# EAGLE design eg4duino_fin (EAGLE 7.2.0)
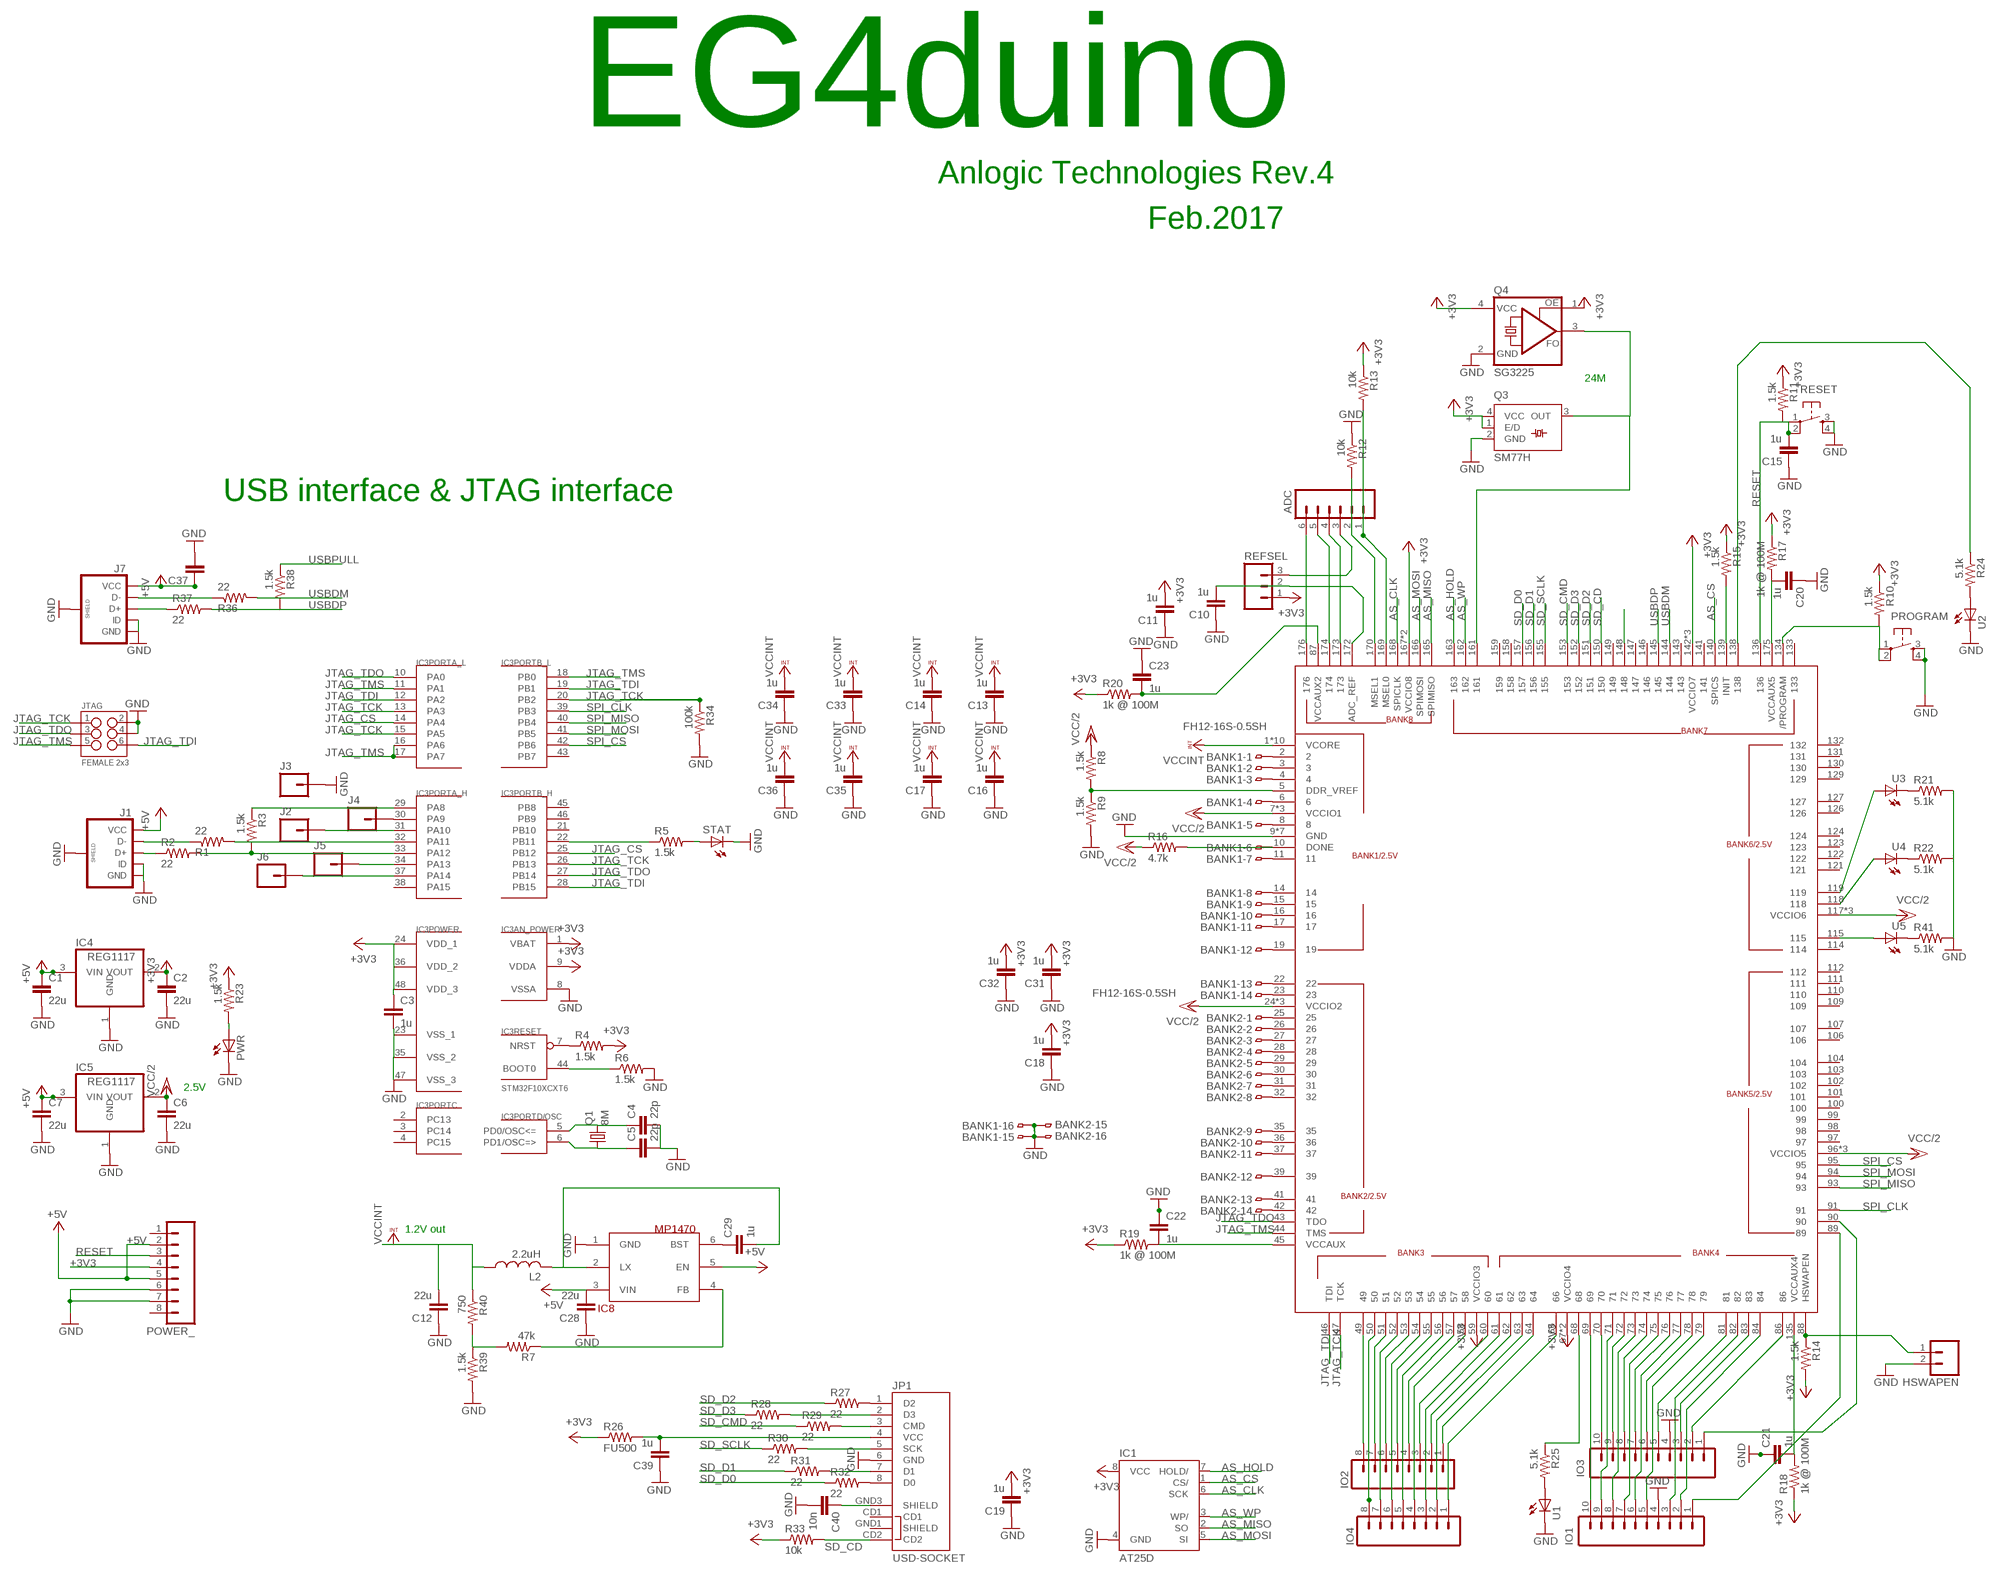
[diagram p0: schematic, sheet 1, part 1 of 2]
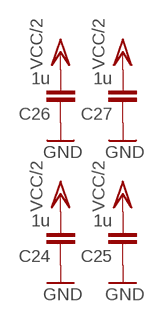
[diagram p1: schematic, sheet 1, part 2 of 2]

## Parts
ADC  M06SILK_FEMALE_PTH  [1X06]
BANK1  FH12-16S-0.5SH  [FH12-16S-0.5SH]
BANK2  FH12-16S-0.5SH  [FH12-16S-0.5SH]
C1  22u  C-EUC0805  [C0805]
C2  22u  C-EUC0805  [C0805]
C3  1u  C-EUC0805  [C0805]
C4  22p  C-EUC0805  [C0805]
C5  22p  C-EUC0805  [C0805]
C6  22u  C-EUC0805  [C0805]
C7  22u  C-EUC0805  [C0805]
C10  1u  C-EUC0805  [C0805]
C11  1u  C-EUC0805  [C0805]
C12  22u  C-EUC0805  [C0805]
C13  1u  C-EUC0805  [C0805]
C14  1u  C-EUC0805  [C0805]
C15  1u  C-EUC0805  [C0805]
C16  1u  C-EUC0805  [C0805]
C17  1u  C-EUC0805  [C0805]
C18  1u  C-EUC0805  [C0805]
C19  1u  C-EUC0805  [C0805]
C20  1u  C-EUC0805  [C0805]
C21  1u  C-EUC0805  [C0805]
C22  1u  C-EUC0805  [C0805]
C23  1u  C-EUC0805  [C0805]
C24  1u  C-EUC0805  [C0805]
C25  1u  C-EUC0805  [C0805]
C26  1u  C-EUC0805  [C0805]
C27  1u  C-EUC0805  [C0805]
C28  22u  C-EUC0805  [C0805]
C29  1u  C-EUC0805  [C0805]
C31  1u  C-EUC0805  [C0805]
C32  1u  C-EUC0805  [C0805]
C33  1u  C-EUC0805  [C0805]
C34  1u  C-EUC0805  [C0805]
C35  1u  C-EUC0805  [C0805]
C36  1u  C-EUC0805  [C0805]
C37  C-EUC0805  [C0805]
C39  1u  C-EUC0805  [C0805]
C40  10n  C-EUC0805  [C0805]
HSWAPEN  M02PTH  [1X02]
IC1  AT25D  [SOIC8]
IC2  EG4D20EG176  [ELQFP176L]
IC3  STM32F10XCXT6  [TQFP48]
IC4  REG1117  [SOT223]
IC5  REG1117  [SOT223]
IC8  MP1470  [SOT23-6L]
IO1  M10SILK_FEMALE_PTH  [1X10]
IO2  M08SILK_FEMALE_PTH  [1X08]
IO3  M10SILK_FEMALE_PTH  [1X10]
IO4  M08SILK_FEMALE_PTH  [1X08]
J1  USB_MICROB_PLUGCONN-11752  [USB-B-MICRO-SMD_V03]
J2  M01  [0805SMD]
J3  M01  [0805SMD]
J4  M01  [0805SMD]
J5  M01  [0805SMD]
J6  M01  [0805SMD]
J7  USB_MICROB_PLUGCONN-11752  [USB-B-MICRO-SMD_V03]
JP1  USD-SOCKET  [MICROSD_1:1]
JTAG  FEMALE 2x3  M03X2FEMALE  [2X3]
L2  2.2uH  L-USL4532P  [L4532P]
POWER_  M08SILK_FEMALE_PTH  [1X08]
PROGRAM  10-XXSMD  [B3F-10SMD]
PWR  LEDCHIP-LED0805  [CHIP-LED0805]
Q1  8M  CRYSTALHC49S  [HC49/S]
Q3  SM77H  [SM77H]
Q4  SG3225  [3225]
R1  22  R-US_M0805  [M0805]
R2  22  R-US_M0805  [M0805]
R3  1.5k  R-US_M0805  [M0805]
R4  1.5k  R-US_M0805  [M0805]
R5  1.5k  R-US_M0805  [M0805]
R6  1.5k  R-US_M0805  [M0805]
R7  47k  R-US_R0805  [R0805]
R8  1.5k  R-US_R0805  [R0805]
R9  1.5k  R-US_R0805  [R0805]
R10  1.5k  R-US_R0603  [R0603]
R11  1.5k  R-US_R0805  [R0805]
R12  10k  R-US_R0805  [R0805]
R13  10k  R-US_R0805  [R0805]
R14  1.5k  R-US_R0805  [R0805]
R15  1.5k  R-US_R0805  [R0805]
R16  4.7k  R-US_R0603  [R0603]
R17  1k @ 100M  R-US_R0805  [R0805]
R18  1k @ 100M  R-US_R0805  [R0805]
R19  1k @ 100M  R-US_R0805  [R0805]
R20  1k @ 100M  R-US_R0805  [R0805]
R21  5.1k  R-US_M0805  [M0805]
R22  5.1k  R-US_M0805  [M0805]
R23  1.5k  R-US_M0805  [M0805]
R24  5.1k  R-US_M0805  [M0805]
R25  5.1k  R-US_M0805  [M0805]
R26  FU500  R-US_R0805  [R0805]
R27  22  R-US_R0201  [R0201]
R28  22  R-US_R0201  [R0201]
R29  22  R-US_R0201  [R0201]
R30  22  R-US_R0201  [R0201]
R31  22  R-US_R0201  [R0201]
R32  22  R-US_R0201  [R0201]
R33  10k  R-US_R0805  [R0805]
R34  100k  R-US_R0603  [R0603]
R36  22  R-US_R0603W  [R0603W]
R37  22  R-US_R0603W  [R0603W]
R38  1.5k  R-US_R0603  [R0603]
R39  1.5k  R-US_R0805  [R0805]
R40  750  R-US_R0805  [R0805]
R41  5.1k  R-US_M0805  [M0805]
REFSEL  M03PTH  [1X03]
RESET  10-XXSMD  [B3F-10SMD]
STAT  LEDCHIP-LED0805  [CHIP-LED0805]
U1  LEDCHIP-LED0805  [CHIP-LED0805]
U2  LEDCHIP-LED0805  [CHIP-LED0805]
U3  LEDCHIP-LED0805  [CHIP-LED0805]
U4  LEDCHIP-LED0805  [CHIP-LED0805]
U5  LEDCHIP-LED0805  [CHIP-LED0805]

## Nets
+3V3: C2.1 C3.1 C11.2 C18.2 C19.2 C31.2 C32.2 IC1.8(VCC) IC2.59(VCCIO3) IC2.67(VCCIO4) IC2.80(VCCIO4) IC2.142(VCCIO7) IC2.154(VCCIO7) IC2.160(VCCIO7) IC2.167(VCCIO8) IC2.171(VCCIO8) IC3.1(AN_POWER:VBAT) IC3.9(AN_POWER:VDDA) IC3.24(POWER:VDD_1) IC3.36(POWER:VDD_2) IC3.48(POWER:VDD_3) IC4.2(VOUT) POWER_.4 Q3.1(E/D) Q3.4(VCC) Q4.1(OE) Q4.4(VCC) R4.2 R10.1 R11.1 R13.1 R14.2 R15.1 R17.1 R18.1 R19.1 R20.1 R23.1 R26.1 R33.1 REFSEL.1
+5V [usbvcc]: C1.1 C7.1 C28.2 C37.1 IC4.3(VIN) IC5.3(VIN) IC8.3(VIN) IC8.5(EN) J1.VBUS(VCC) J7.VBUS(VCC) POWER_.2 POWER_.5
AS_CLK: IC1.6(SCK) IC2.168(SPICLK)
AS_CS: IC1.1(CS/) IC2.140(SPICS)
AS_HOLD: IC1.7(HOLD/) IC2.163
AS_MISO: IC1.2(SO) IC2.165(SPIMISO)
AS_MOSI: IC1.5(SI) IC2.166(SPIMOSI)
AS_WP: IC1.3(WP/) IC2.162
GND [gnd]: BANK1.15 BANK1.16 BANK2.15 BANK2.16 C1.2 C2.2 C3.2 C4.2 C5.2 C6.2 C7.2 C10.1 C11.1 C12.1 C13.1 C14.1 C15.1 C16.1 C17.1 C18.1 C19.1 C20.1 C21.1 C22.1 C23.1 C24.1 C25.1 C26.1 C27.1 C28.1 C31.1 C32.1 C33.1 C34.1 C35.1 C36.1 C37.2 C39.1 C40.2 HSWAPEN.2 IC1.4(GND) IC2.9(GND) IC2.13(GND) IC2.21(GND) IC2.33(GND) IC2.38(GND) IC2.116(GND) IC2.EGND(GND) IC3.8(AN_POWER:VSSA) IC3.23(POWER:VSS_1) IC3.35(POWER:VSS_2) IC3.47(POWER:VSS_3) IC4.1(GND) IC5.1(GND) IC8.1(GND) IO1.4 IO3.4 J1.GND J1.ID J1.SHIELD1(SHIELD) J1.SHIELD2(SHIELD) J1.SHIELD3(SHIELD) J3.1 J7.GND J7.ID J7.SHIELD1(SHIELD) J7.SHIELD2(SHIELD) J7.SHIELD3(SHIELD) JP1.6(GND) JTAG.2 JTAG.4 POWER_.6 POWER_.7 PROGRAM.3(S) PROGRAM.4(S1) PWR.C Q3.2(GND) Q4.2(GND) R6.2 R9.2 R12.1 R21.2 R22.2 R34.2 R39.2 R41.2 RESET.3(S) RESET.4(S1) STAT.C U1.C U2.C
JTAG_CS: IC3.14(PORTA_L:PA4) IC3.25(PORTB_H:PB12)
JTAG_TCK: IC2.47(TCK) IC3.13(PORTA_L:PA3) IC3.15(PORTA_L:PA5) IC3.20(PORTB_L:PB2) IC3.26(PORTB_H:PB13) JTAG.1 R34.1
JTAG_TDI: IC2.46(TDI) IC3.12(PORTA_L:PA2) IC3.19(PORTB_L:PB1) IC3.28(PORTB_H:PB15) JTAG.6
JTAG_TDO: IC2.43(TDO) IC3.10(PORTA_L:PA0) IC3.27(PORTB_H:PB14) JTAG.3
JTAG_TMS: IC2.44(TMS) IC3.11(PORTA_L:PA1) IC3.16(PORTA_L:PA6) IC3.17(PORTA_L:PA7) IC3.18(PORTB_L:PB0) JTAG.5
N$1: ADC.6 IC2.176
N$2: ADC.5 IC2.174
N$3: ADC.4 IC2.173
N$4: ADC.3 REFSEL.3
N$5: ADC.2 IC2.170(MSEL1) R12.2
N$6: ADC.1 IC2.169(MSEL0) R13.2
N$7: IC2.69 IO1.10
N$8: IC2.70 IO3.10
N$9: IC2.71 IO1.9
N$10: IC2.72 IO3.9
N$11: IC2.73 IO1.8
N$12: IC2.74 IO3.8
N$13: IC2.75 IO1.7
N$14: IC2.76 IO3.7
N$15: IC2.77 IO1.6
N$16: IC2.78 IO3.6
N$17: IC2.79 IO1.5
N$18: IC2.83 IO3.3
N$19: IC2.81 IO3.5
N$20: IC2.82 IO1.3
N$21: IC2.84 IO1.2
N$22: IC2.86 IO3.2
N$23: IC2.89 IO1.1
N$24: IC2.90 IO3.1
N$25: J1.D+ R2.1
N$26: J1.D- R1.1
N$27: IC3.32(PORTA_H:PA11) R1.2
N$28: IC3.33(PORTA_H:PA12) R2.2 R3.2
N$29: IC3.29(PORTA_H:PA8) R3.1
N$30: IC3.31(PORTA_H:PA10) J2.1
N$31: IC3.30(PORTA_H:PA9) J4.1
N$32: IC3.7(RESET:NRST) R4.1
N$33: IC3.22(PORTB_H:PB11) R5.1
N$34: R5.2 STAT.A
N$35: C4.1 IC3.5(PORTD/OSC:PD0/OSC<=) Q1.2
N$36: C5.1 IC3.6(PORTD/OSC:PD1/OSC=>) Q1.1
N$37: IC3.44(RESET:BOOT0) R6.1
N$38: IC2.49 IO2.8
N$40: IC2.51 IO2.7
N$42: IC2.53 IO2.6
N$43: IC2.54 IO4.6
N$44: IC2.55 IO2.5
N$45: IC2.56 IO4.5
N$46: IC2.57 IO2.4
N$47: IC2.58 IO4.4
N$48: IC2.60 IO2.3
N$49: IC2.61 IO4.3
N$50: IC2.62 IO2.2
N$51: IC2.63 IO4.2
N$52: IC2.64 IO2.1
N$53: IC2.66 IO4.1
N$54: IC2.161 Q3.3(OUT) Q4.3(FO)
N$55: C10.2 IC2.172(ADC_REF) REFSEL.2
N$56: IC2.119 U3.A
N$57: IC2.118 U4.A
N$58: C29.2 IC8.2(LX) L2.2
N$59: C29.1 IC8.6(BST)
N$60: IC8.4(FB) R7.1
N$61: R7.2 R39.1 R40.2
N$62: IC2.5(DDR_VREF) R8.2 R9.1
N$63: BANK1.1 IC2.2
N$64: BANK1.2 IC2.3
N$65: BANK1.3 IC2.4
N$66: BANK1.4 IC2.6
N$67: BANK1.5 IC2.8
N$68: IC3.34(PORTA_H:PA13) J5.1
N$69: BANK1.7 IC2.11
N$70: BANK1.8 IC2.14
N$71: BANK1.9 IC2.15
N$72: BANK1.10 IC2.16
N$73: BANK1.11 IC2.17
N$74: BANK1.12 IC2.19
N$75: BANK1.13 IC2.22
N$76: BANK1.14 IC2.23
N$77: BANK2.1 IC2.25
N$78: BANK2.2 IC2.26
N$79: BANK2.3 IC2.27
N$80: BANK2.4 IC2.28
N$81: BANK2.5 IC2.29
N$82: BANK2.6 IC2.30
N$83: BANK2.7 IC2.31
N$84: BANK2.8 IC2.32
N$85: BANK2.9 IC2.35
N$86: BANK2.10 IC2.36
N$87: BANK2.11 IC2.37
N$88: BANK2.12 IC2.39
N$89: BANK2.13 IC2.41
N$90: BANK2.14 IC2.42
N$91: C20.2 IC2.175(VCCAUX5) R17.2
N$92: HSWAPEN.1 IC2.88(HSWAPEN) R14.1
N$93: IC2.139(INIT) R15.2
N$94: C21.2 IC2.135(VCCAUX4) R18.2
N$95: C22.2 IC2.45(VCCAUX) R19.2
N$96: C23.2 IC2.87(VCCAUX2) R20.2
N$97: IC2.115 U5.A
N$98: PWR.A R23.2
N$99: R24.2 U2.A
N$100: IC2.138 R24.1
N$101: R25.2 U1.A
N$102: IC2.68 R25.1
N$103: C39.2 JP1.4(VCC) R26.2
N$104: JP1.1(D2) R27.2
N$105: IC2.134(/PROGRAM) PROGRAM.1(P) PROGRAM.2(P1) R10.2
N$106: JP1.2(D3) R28.2
N$107: JP1.3(CMD) R29.2
N$108: JP1.8(D0) R32.2
N$109: JP1.7(D1) R31.2
N$110: IC3.37(PORTA_H:PA14) J6.1
N$111: JP1.5(SCK) R30.2
N$112: C40.1 JP1.GND3(SHIELD)
N$114: BANK1.6 IC2.10(DONE) R16.2
N$116: J7.D- R36.1
N$117: J7.D+ R37.1
N$118: R21.1 U3.C
N$119: R22.1 U4.C
N$120: R41.1 U5.C
RESET: C15.2 IC2.136 POWER_.3 R11.2 RESET.1(P) RESET.2(P1)
SD_CD: IC2.150 JP1.CD2 R33.2
SD_CMD: IC2.153 R29.1
SD_D0: IC2.157 R32.1
SD_D1: IC2.156 R31.1
SD_D2: IC2.151 R27.1
SD_D3: IC2.152 R28.1
SD_SCLK: IC2.155 R30.1
SPI_CLK: IC2.91 IC3.39(PORTB_L:PB3)
SPI_CS: IC2.95 IC3.42(PORTB_L:PB6)
SPI_MISO: IC2.93 IC3.40(PORTB_L:PB4)
SPI_MOSI: IC2.94 IC3.41(PORTB_L:PB5)
USBDM: IC2.144 R36.2
USBDP: IC2.145 R37.2 R38.2
USBPULL: IC2.148 R38.1
USER_RX: IC2.52 IO4.7
USER_TX: IC2.50 IO4.8
VCC/2: C6.1 C24.2 C25.2 C26.2 C27.2 IC2.7(VCCIO1) IC2.12(VCCIO1) IC2.18(VCCIO1) IC2.24(VCCIO2) IC2.34(VCCIO2) IC2.40(VCCIO2) IC2.96(VCCIO5) IC2.105(VCCIO5) IC2.108(VCCIO5) IC2.117(VCCIO6) IC2.120(VCCIO6) IC2.125(VCCIO6) IC5.2(VOUT) R8.1 R16.1
VCCINT: C12.2 C13.2 C14.2 C16.2 C17.2 C33.2 C34.2 C35.2 C36.2 IC2.1(VCORE) IC2.20(VCORE) IC2.48(VCORE) IC2.65(VCORE) IC2.85(VCORE) IC2.92(VCORE) IC2.113(VCORE) IC2.128(VCORE) IC2.137(VCORE) IC2.164(VCORE) L2.1 R40.1
Unconnected: IC2.97 IC2.98 IC2.99 IC2.100 IC2.101 IC2.102 IC2.103 IC2.104 IC2.106 IC2.107 IC2.109 IC2.110 IC2.111 IC2.112 IC2.114 IC2.121 IC2.122 IC2.123 IC2.124 IC2.126 IC2.127 IC2.129 IC2.130 IC2.131 IC2.132 IC2.133 IC2.141 IC2.143 IC2.146 IC2.147 IC2.149 IC2.158 IC2.159 IC3.2(PORTC:PC13) IC3.3(PORTC:PC14) IC3.4(PORTC:PC15) IC3.21(PORTB_H:PB10) IC3.38(PORTA_H:PA15) IC3.43(PORTB_L:PB7) IC3.45(PORTB_H:PB8) IC3.46(PORTB_H:PB9) JP1.CD1 JP1.GND1(SHIELD) POWER_.1 POWER_.8

## Notes on the sheet
- EG4duino
- Anlogic Technologies Rev.4
- Feb.2017
- 24M
- USB interface & JTAG interface
- 2.5V
- 1.2V out

## Library data of the parts
ADC = SparkFun-Connectors:M06: Header 6 Standard 6-pin 0.1" header. Use with straight break away headers (SKU : PRT-00116), right angle break away headers (PRT-00553), swiss pins (PRT-00743), machine pins (PRT-00117), and female headers (PRT-00115). Molex polarized connector foot print use with SKU : PRT-08094 with associated crimp pins and housings. NOTES ON THE VARIANTS LOCK and LOCK_LONGPADS... This footprint was designed to help hold the alignment of a through-hole component (i.e. 6-pin header) while soldering it into place. You may notice that each hole has been shifted either up or down by 0.005 of an inch from it's more standard position (which is a perfectly straight line). This slight alteration caused the pins (the squares in the middle) to touch the edges of the holes. Because they are alternating, it causes a "brace" to hold the component in place. 0.005 has proven to be the perfect amount of "off-center" position when using our standard breakaway headers. Although looks a little odd when you look at the bare footprint, once you have a header in there, the alteration is very hard to notice. Also,if you push a header all the way into place, it is covered up entirely on the bottom side. This idea of altering the position of holes to aid alignment will be further integrated into the Sparkfun Library for other footprints. It can help hold any component with 3 or more connection pins.; PROD_ID: CONN-08437
BANK1 BANK2 = con-hirose:FH12-16S-0.5S: 0.5mm Pitch Connectors For FPC/FFC Source: Data sheet <http://www.hirose.co.jp/cataloge_hp/e58605370.pdf>; MPN: FH12-16S-0.5SH(55); OC_FARNELL: 1324546; OC_NEWARK: 34M6162
C1-C7 C10-C29 C31-C37 C39 C40 = rcl:C-EU: CAPACITOR, European symbol
HSWAPEN = SparkFun-Connectors:M02: Standard 2-pin 0.1" header. Use with - straight break away headers ( PRT-00116) - right angle break away headers (PRT-00553) - swiss pins (PRT-00743) - machine pins (PRT-00117) - female headers (PRT-00115) Molex polarized connector foot print use with: PRT-08233 with associated crimp pins and housings. 2.54_SCREWTERM for use with PRT-10571. 3.5mm Screw Terminal footprints for PRT-08084 5mm Screw Terminal footprints for use with PRT-08432
IC1 = atmel:AT25*: SPI bus serial EEPROM
IC2 = anlogic:EG4D20EG176
IC3 = stm32:STM32F10XCXT6: ST STM32F101/103 48pin LQFP
IC4 IC5 = burr-brown:REG1117: 800mA and 1A Low Dropout (LDO) Positive Regulator 1.8V, 2.5V, 2.85V, 3.3V, 5V, and Adj; MPN: REG1117; OC_FARNELL: 1097566; OC_NEWARK: 14P6981
IC8 = maxim:MP1470
IO1 IO3 = SparkFun-Connectors:M10: Header 10 Standard 10-pin 0.1" header. Use with straight break away headers (SKU : PRT-00116), right angle break away headers (PRT-00553), swiss pins (PRT-00743), machine pins (PRT-00117), and female headers (PRT-00115).; PROD_ID: CONN-11563
IO2 IO4 POWER_ = SparkFun-Connectors:M08: Header 8 Standard 8-pin 0.1" header. Use with straight break away headers (SKU : PRT-00116), right angle break away headers (PRT-00553), swiss pins (PRT-00743), machine pins (PRT-00117), and female headers (PRT-00115).; PROD_ID: CONN-08438
J1 J7 = SparkFun-Connectors:USB_MICROB_PLUG: USB Micro-B connectors Some male, some female. Watch your step!; PROD_ID: CONN-11752
J2-J6 = SparkFun-Connectors:M01: Header 1 Standard 1-pin 0.1" header. Use with straight break away headers (SKU : PRT-00116), right angle break away headers (PRT-00553), swiss pins (PRT-00743), machine pins (PRT-00117), and female headers (PRT-00115). SMTSO-256-ET is a "flush mount" nut for a 4-40 screw. The older package used to be too tight, and did not allow it to sit properly thru the drill hit. The latest (0.165DIA) fits nice and snug.
JP1 = SparkFun-Connectors:USD-SOCKET: microSD Socket Push-push type uSD socket. Schematic element and footprint production proven. Spark Fun Electronics SKU : PRT-00127. tDoc lines correctly indicate media card edge positions when inserting (unlocked, locked, depressed). NOTE: CD1 and CD2 are connected internally; PROD_ID: CONN-07820
JTAG = SparkFun-Connectors:M03X2: 2x3 .1" header. Shrouded, with keying- CONN-10681 SMT- CONN-11415 Pogo pins- HW-11044; PROD_ID: CONN-11566
L2 = rcl:L-US: INDUCTOR, American symbol
PROGRAM RESET = switch-omron:10-XX: OMRON SWITCH
PWR STAT U1-U5 = led:LED: LED OSRAM: - CHIPLED LG R971, LG N971, LY N971, LG Q971, LY Q971, LO R971, LY R971 LH N974, LH R974 LS Q976, LO Q976, LY Q976 LO Q996 - Hyper CHIPLED LW Q18S LB Q993, LB Q99A, LB R99A - SideLED LS A670, LO A670, LY A670, LG A670, LP A670 LB A673, LV A673, LT A673, LW A673 LH A674 LY A675 LS A676, LA A676, LO A676, LY A676, LW A676 LS A679, LY A679, LG A679 - Hyper Micro SIDELED® LS Y876, LA Y876, LO Y876, LY Y876 LT Y87S - SmartLED LW L88C, LW L88S LB L89C, LB L89S, LG L890 LS L89K, LO L89K, LY L89K LS L896, LA L896, LO L896, LY L896 - TOPLED LS T670, LO T670, LY T670, LG T670, LP T670 LSG T670, LSP T670, LSY T670, LOP T670, LYG T670 LG T671, LOG T671, LSG T671 LB T673, LV T673, LT T673, LW T673 LH T674 LS T676, LA T676, LO T676, LY T676, LB T676, LH T676, LSB T676, LW T676 LB T67C, LV T67C, LT T67C, LS T67K, LO T67K, LY T67K, LW E67C LS E67B, LA E67B, LO E67B, LY E67B, LB E67C, LV E67C, LT E67C LW T67C LS T679, LY T679, LG T679 LS T770, LO T770, LY T770, LG T770, LP T770 LB T773, LV T773, LT T773, LW T773 LH T774 LS E675, LA E675, LY E675, LS T675 LS T776, LA T776, LO T776, LY T776, LB T776 LHGB T686 LT T68C, LB T68C - Hyper Mini TOPLED® LB M676 - Mini TOPLED Santana® LG M470 LS M47K, LO M47K, LY M47K Source: http://www.osram.convergy.de LUXEON: - LUMILED® LXK2-PW12-R00, LXK2-PW12-S00, LXK2-PW14-U00, LXK2-PW14-V00 LXK2-PM12-R00, LXK2-PM12-S00, LXK2-PM14-U00 LXK2-PE12-Q00, LXK2-PE12-R00, LXK2-PE12-S00, LXK2-PE14-T00, LXK2-PE14-U00 LXK2-PB12-K00, LXK2-PB12-L00, LXK2-PB12-M00, LXK2-PB14-N00, LXK2-PB14-P00, LXK2-PB14-Q00 LXK2-PR12-L00, LXK2-PR12-M00, LXK2-PR14-Q00, LXK2-PR14-R00 LXK2-PD12-Q00, LXK2-PD12-R00, LXK2-PD12-S00 LXK2-PH12-R00, LXK2-PH12-S00 LXK2-PL12-P00, LXK2-PL12-Q00, LXK2-PL12-R00 Source: www.luxeon.com KINGBRIGHT: KA-3528ASYC Source: www.kingbright.com
Q1 = crystal:CRYSTAL: CRYSTAL; OC_FARNELL: 1667008; OC_NEWARK: unknown
Q3 = crystal:SM77H: 3.3V CMOS Clock Oscillator Source: www.pletronics.com .. sm77h%203.3v.pdf; OC_FARNELL: unknown; OC_NEWARK: unknown
Q4 = crystal:SG3225
R1-R34 R36-R41 = rcl:R-US_: RESISTOR, American symbol
REFSEL = SparkFun-Connectors:M03: Header 3 Standard 3-pin 0.1" header. Use with straight break away headers (SKU : PRT-00116), right angle break away headers (PRT-00553), swiss pins (PRT-00743), machine pins (PRT-00117), and female headers (PRT-00115). Molex polarized connector foot print use with SKU : PRT-08232 with associated crimp pins and housings.

## Net classes
0 default: width 0.254 mm, clearance 0.254 mm
1 power: width 0.61 mm, drill 0.61 mm, clearance 0.254 mm
2 gnd: width 0.305 mm, drill 0.559 mm, clearance 0.254 mm
3 usbvcc: width 0.508 mm, drill 0.61 mm, clearance 0.254 mm
4 aref: width 0.406 mm, drill 0.61 mm, clearance 0.254 mm

## Board
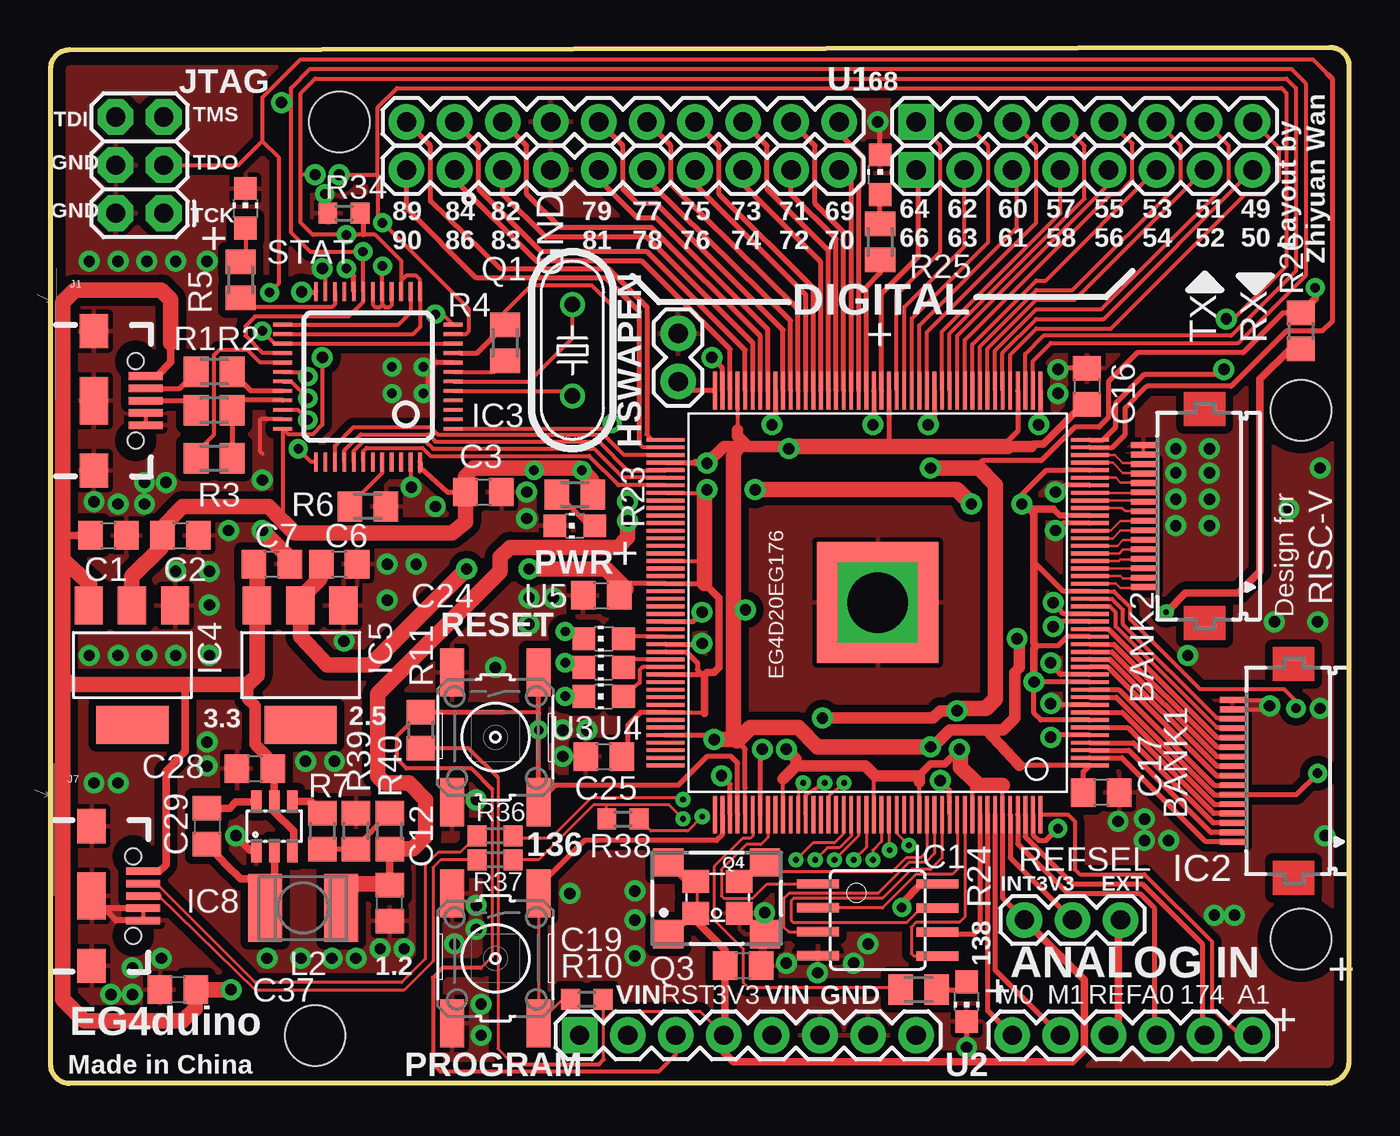
[diagram p2: board, top side]
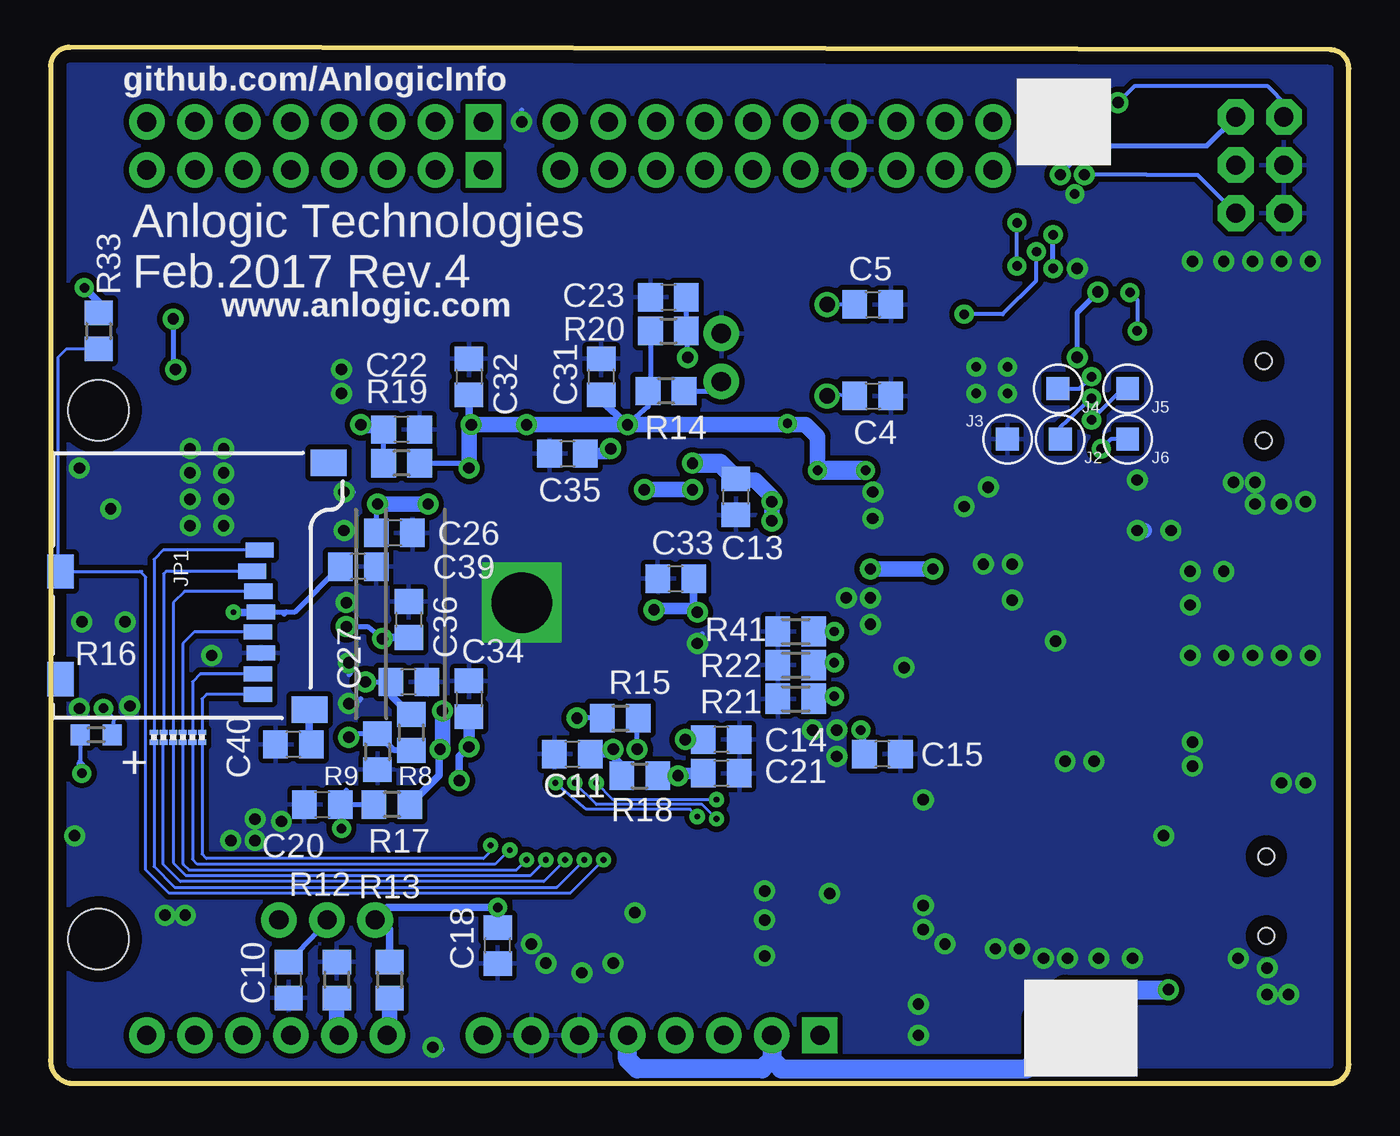
[diagram p3: board, bottom side, seen from below]

Size 68.58 x 54.74 mm. Coordinates in mm from the lower left corner, seen from the top.
Outline: 68.58,53.72 68.58,1.25 arc-90 67.45,0 1,0 arc-90 0,1 0,53.61 arc-90 1,54.61 67.56,54.74
Outline: 67.58,54.74 arc-90 68.58,53.74
Copper layers (1*16): Top 0.035mm / dielectric 1.5mm / Bottom 0.035mm
Design rules "default *": minimum track width 5mil, minimum drill 22mil, track to track 5mil, track to pad 5mil, pad to pad 5mil, via to via 5mil, smd to smd 5mil, copper to edge 26mil, drill to drill 12mil, minimum pad ring 10mil, minimum via ring 10mil, stop-mask expansion 1mil, vias tented up to drill 30mil, thermal gap 10mil
Holes 3.2 mm at 66.04,35.56 66.04,7.62 15.24,50.8 13.97,2.54
vRestrict: area 22.9,44.1 to 24.6,49.1; area 25.4,45.5 to 27.1,49.1; area 28.4,45.3 to 29.6,48.8; area 31,45.3 to 32.1,48.8; area 33.5,45.3 to 34.7,48.8; area 36.1,45.3 to 37.2,48.8; area 38.7,47.2 to 39.9,48.8; area 40.3,45.1 to 47.6,46.9; area 60.3,44.2 to 61.7,46.7; area 62.9,44.2 to 64.3,46.7; area 61.3,35.8 to 64.8,37.2; area 0.6,21.8 to 2,30.1; 14 more areas

### Footprints (pad centres in the part's own frame; a part is rotated, then mirrored left to right if it is on the bottom)
1X06 = drill 1.016 pad 1.88: 1 0,0; 2 2.54,0; 3 5.08,0; 4 7.62,0; 5 10.16,0; 6 12.7,0
FH12-16S-0.5SH = smd 0.3 x 1.3: 1 -3.75,3.25; 2 -3.25,3.25; 3 -2.75,3.25; 4 -2.25,3.25; 5 -1.75,3.25; 6 -1.25,3.25; 7 -0.75,3.25; 8 -0.25,3.25; 9 0.25,3.25; 10 0.75,3.25; 11 1.25,3.25; 12 1.75,3.25; 13 2.25,3.25; 14 2.75,3.25; 15 3.25,3.25; 16 3.75,3.25
C0805 = smd 1.3 x 1.5: 1 -0.95,0; 2 0.95,0
1X02 = drill 1.016 pad 1.88: 1 0,0; 2 2.54,0
SOIC8 = smd 0.5 x 2.2: 1 -1.905,-3.154; 2 -0.645,-3.154; 3 0.625,-3.154; 4 1.895,-3.154; 5 1.905,3.154; 6 0.635,3.154; 7 -0.635,3.154; 8 -1.905,3.154
ELQFP176L = smd 0.2 x 2: 1 -8.6,-11.2; 2 -8.2,-11.2; 3 -7.8,-11.2; 4 -7.4,-11.2; 5 -7,-11.2; 6 -6.6,-11.2; 7 -6.2,-11.2; 8 -5.8,-11.2; 9 -5.4,-11.2; 10 -5,-11.2; 11 -4.6,-11.2; 12 -4.2,-11.2; 13 -3.8,-11.2; 14 -3.4,-11.2; 15 -3,-11.2; 16 -2.6,-11.2; 17 -2.2,-11.2; 18 -1.8,-11.2; 19 -1.4,-11.2; 20 -1,-11.2; 21 -0.6,-11.2; 22 -0.2,-11.2; 23 0.2,-11.2; 24 0.6,-11.2; 25 1,-11.2; 26 1.4,-11.2; 27 1.8,-11.2; 28 2.2,-11.2; 29 2.6,-11.2; 30 3,-11.2; 31 3.4,-11.2; 32 3.8,-11.2; 33 4.2,-11.2; 34 4.6,-11.2; 35 5,-11.2; 36 5.4,-11.2; 37 5.8,-11.2; 38 6.2,-11.2; 39 6.6,-11.2; 40 7,-11.2; 41 7.4,-11.2; 42 7.8,-11.2; 43 8.2,-11.2; 44 8.6,-11.2; 89 8.6,11.2; 90 8.2,11.2; 91 7.8,11.2; 92 7.4,11.2; 93 7,11.2; 94 6.6,11.2; 95 6.2,11.2; 96 5.8,11.2; 97 5.4,11.2; 98 5,11.2; 99 4.6,11.2; 100 4.2,11.2; 101 3.8,11.2; 102 3.4,11.2; 103 3,11.2; 104 2.6,11.2; 105 2.2,11.2; 106 1.8,11.2; 107 1.4,11.2; 108 1,11.2; 109 0.6,11.2; 110 0.2,11.2; 111 -0.2,11.2; 112 -0.6,11.2; 113 -1,11.2; 114 -1.4,11.2; 115 -1.8,11.2; 116 -2.2,11.2; 117 -2.6,11.2; 118 -3,11.2; 119 -3.4,11.2; 120 -3.8,11.2; 121 -4.2,11.2; 122 -4.6,11.2; 123 -5,11.2; 124 -5.4,11.2; 125 -5.8,11.2; 126 -6.2,11.2; 127 -6.6,11.2; 128 -7,11.2; 129 -7.4,11.2; 130 -7.8,11.2; 131 -8.2,11.2; 132 -8.6,11.2 | smd 2 x 0.2: 45 11.2,-8.6; 46 11.2,-8.2; 47 11.2,-7.8; 48 11.2,-7.4; 49 11.2,-7; 50 11.2,-6.6; 51 11.2,-6.2; 52 11.2,-5.8; 53 11.2,-5.4; 54 11.2,-5; 55 11.2,-4.6; 56 11.2,-4.2; 57 11.2,-3.8; 58 11.2,-3.4; 59 11.2,-3; 60 11.2,-2.6; 61 11.2,-2.2; 62 11.2,-1.8; 63 11.2,-1.4; 64 11.2,-1; 65 11.2,-0.6; 66 11.2,-0.2; 67 11.2,0.2; 68 11.2,0.6; 69 11.2,1; 70 11.2,1.4; 71 11.2,1.8; 72 11.2,2.2; 73 11.2,2.6; 74 11.2,3; 75 11.2,3.4; 76 11.2,3.8; 77 11.2,4.2; 78 11.2,4.6; 79 11.2,5; 80 11.2,5.4; 81 11.2,5.8; 82 11.2,6.2; 83 11.2,6.6; 84 11.2,7; 85 11.2,7.4; 86 11.2,7.8; 87 11.2,8.2; 88 11.2,8.6; 133 -11.2,8.6; 134 -11.2,8.2; 135 -11.2,7.8; 136 -11.2,7.4; 137 -11.2,7; 138 -11.2,6.6; 139 -11.2,6.2; 140 -11.2,5.8; 141 -11.2,5.4; 142 -11.2,5; 143 -11.2,4.6; 144 -11.2,4.2; 145 -11.2,3.8; 146 -11.2,3.4; 147 -11.2,3; 148 -11.2,2.6; 149 -11.2,2.2; 150 -11.2,1.8; 151 -11.2,1.4; 152 -11.2,1; 153 -11.2,0.6; 154 -11.2,0.2; 155 -11.2,-0.2; 156 -11.2,-0.6; 157 -11.2,-1; 158 -11.2,-1.4; 159 -11.2,-1.8; 160 -11.2,-2.2; 161 -11.2,-2.6; 162 -11.2,-3; 163 -11.2,-3.4; 164 -11.2,-3.8; 165 -11.2,-4.2; 166 -11.2,-4.6; 167 -11.2,-5; 168 -11.2,-5.4; 169 -11.2,-5.8; 170 -11.2,-6.2; 171 -11.2,-6.6; 172 -11.2,-7; 173 -11.2,-7.4; 174 -11.2,-7.8; 175 -11.2,-8.2; 176 -11.2,-8.6 | smd 6.4 x 6.4: EGND 0,0
TQFP48 = smd 0.2 x 1: 1 -2.75,-4.5; 2 -2.25,-4.5; 3 -1.75,-4.5; 4 -1.25,-4.5; 5 -0.75,-4.5; 6 -0.25,-4.5; 7 0.25,-4.5; 8 0.75,-4.5; 9 1.25,-4.5; 10 1.75,-4.5; 11 2.25,-4.5; 12 2.75,-4.5; 25 2.75,4.5; 26 2.25,4.5; 27 1.75,4.5; 28 1.25,4.5; 29 0.75,4.5; 30 0.25,4.5; 31 -0.25,4.5; 32 -0.75,4.5; 33 -1.25,4.5; 34 -1.75,4.5; 35 -2.25,4.5; 36 -2.75,4.5 | smd 1 x 0.2: 13 4.5,-2.75; 14 4.5,-2.25; 15 4.5,-1.75; 16 4.5,-1.25; 17 4.5,-0.75; 18 4.5,-0.25; 19 4.5,0.25; 20 4.5,0.75; 21 4.5,1.25; 22 4.5,1.75; 23 4.5,2.25; 24 4.5,2.75; 37 -4.5,2.75; 38 -4.5,2.25; 39 -4.5,1.75; 40 -4.5,1.25; 41 -4.5,0.75; 42 -4.5,0.25; 43 -4.5,-0.25; 44 -4.5,-0.75; 45 -4.5,-1.25; 46 -4.5,-1.75; 47 -4.5,-2.25; 48 -4.5,-2.75
SOT223 = smd 1.499 x 2.007: 1 -2.261,-3.15; 2 0.025,-3.15; 3 2.311,-3.15 | smd 3.81 x 2.007: 4 0,3.15
SOT23-6L = smd 0.55 x 1.2: 1 -0.95,-1.3; 2 0,-1.3; 3 0.95,-1.3; 4 0.95,1.3; 5 0,1.3; 6 -0.95,1.3
1X10 = drill 1.016 pad 1.88: 1 0,0; 2 2.54,0; 3 5.08,0; 4 7.62,0; 5 10.16,0; 6 12.7,0; 7 15.24,0; 8 17.78,0; 9 20.32,0; 10 22.86,0
1X08 = drill 1.016 pad 1.88 square: 1 0,0 | drill 1.016 pad 1.88: 2 2.54,0; 3 5.08,0; 4 7.62,0; 5 10.16,0; 6 12.7,0; 7 15.24,0; 8 17.78,0
USB-B-MICRO-SMD_V03 = smd 1.8 x 0.4: D+ 2.725,0; D- 2.725,0.65; GND 2.725,-1.3; ID 2.725,-0.65; VBUS 2.725,1.3 | smd 1.5 x 1.8: SHIELD1 0,3.685; SHIELD2 0,-3.685 | smd 1.5 x 2.5: SHIELD3 0,0 | hole 0.85: 2.2,2.1; 2.2,-2.1
0805SMD = smd 1.2 x 1.2: 1 0,0
MICROSD_1:1 = smd 0.8 x 1.5: 1 5.096,10.919; 2 6.218,10.519; 3 7.274,10.853; 4 8.367,10.982; 5 9.421,10.828; 6 10.539,10.973; 7 11.648,10.819; 8 12.721,10.819 | smd 1.8 x 1.4: CD1 11.92,0.4; CD2 6.22,0.4 | smd 1.4 x 1.9: GND1 0.497,14.55; GND3 13.52,13.55
2X3 = drill 1.016 pad 1.88 octagon: 1 0,0; 2 0,2.54; 3 2.54,0; 4 2.54,2.54; 5 5.08,0; 6 5.08,2.54
L4532P = smd 1.8 x 3.6: 1 -2,0; 2 2,0
B3F-10SMD = smd 2.54 x 1.27: 1 -3.429,2.286; 2 3.429,2.286; 3 -3.429,-2.286; 4 3.429,-2.286
CHIP-LED0805 = smd 1.2 x 1.2: A 0,-1.05; C 0,1.05
HC49/S = drill 0.813: 1 -2.413,0; 2 2.413,0
SM77H = smd 1.6 x 1.5: 1 -2.55,-1.9; 2 2.55,-1.9; 3 2.55,1.9; 4 -2.55,1.9
3225 = smd 1.4 x 1.2: 1 -1.1,-0.8; 2 1.2,-0.8; 3 1.2,0.9; 4 -1.1,0.9
M0805 = smd 1.3 x 1.6: 1 -0.95,0; 2 0.95,0
R0805 = smd 1.3 x 1.5: 1 -0.95,0; 2 0.95,0
R0603 = smd 1 x 1.1: 1 -0.85,0; 2 0.85,0
R0201 = smd 0.28 x 0.43: 1 -0.255,0; 2 0.255,0
R0603W = smd 1 x 1.1: 1 -0.95,0; 2 0.95,0
1X03 = drill 1.016 pad 1.88: 1 0,0; 2 2.54,0; 3 5.08,0

### Placement (x,y rotation side)
ADC  50.8,2.54 0 top
BANK1  65.66,16.51 90 top
BANK2  60.96,29.97 90 top
C1  3.05,28.96 0 top
C2  6.86,28.96 0 top
C3  22.86,31.24 0 top
C4  25.15,36.32 0 bottom
C5  25.15,41.15 0 bottom
C6  15.24,27.43 0 top
C7  11.68,27.43 0 top
C10  56.01,5.46 90 bottom
C11  41.02,17.4 0 bottom
C12  17.91,9.53 90 top
C13  32.38,30.99 90 bottom
C14  33.15,18.16 180 bottom
C15  24.64,17.4 180 bottom
C16  54.74,36.83 270 top
C17  55.5,15.37 180 top
C18  44.96,7.29 90 bottom
C19  36.58,6.22 180 top
C20  54.23,14.73 0 bottom
C21  33.15,16.38 180 bottom
C22  50.04,34.54 180 bottom
C23  35.94,41.53 0 bottom
C24  29.08,25.78 0 top
C25  29.21,17.27 0 top
C26  50.42,29.08 180 bottom
C27  49.66,21.21 180 bottom
C28  10.79,16.64 0 top
C29  8.26,13.59 270 top
C31  39.5,37.34 270 bottom
C32  46.48,37.34 270 bottom
C33  35.56,26.67 0 bottom
C34  46.48,20.32 270 bottom
C35  41.27,33.27 0 bottom
C36  49.66,24.51 270 bottom
C37  6.73,4.95 180 top
C39  52.32,27.3 180 bottom
C40  55.75,17.91 180 bottom
HSWAPEN  33.15,37.08 90 top
IC1  43.69,8.64 270 top
IC2  43.69,25.4 90 top
IC3  16.76,37.34 90 top
IC4  4.32,22.1 180 top
IC5  13.21,22.1 180 top
IC8  11.81,13.59 0 top
IO1  18.8,50.8 0 top
IO2  45.72,50.8 0 top
IO3  18.8,48.26 0 top
IO4  45.72,48.26 0 top
J1  2.29,36.07 0 top
J2  15.24,34.04 0 bottom
J3  18.03,34.04 180 bottom
J4  15.37,36.7 0 bottom
J5  11.68,36.7 0 bottom
J6  11.68,34.04 0 bottom
J7  2.16,9.91 0 top
JP1  68.45,33.27 270 bottom
JTAG  5.97,45.97 90 top
L2  13.34,9.27 180 top
POWER_  27.94,2.54 0 top
PROGRAM  23.5,6.6 270 top
PWR  27.69,29.46 90 top
Q1  27.56,38.73 270 top
Q3  35.18,9.78 0 top
Q4  35.18,9.78 0 top
R1  8.64,37.59 0 top
R2  8.64,35.56 0 top
R3  8.64,33.02 0 top
R4  24,39.12 90 top
R5  10.03,42.44 90 top
R6  16.76,30.48 0 top
R7  14.35,13.34 270 top
R8  49.53,18.54 270 bottom
R9  51.31,17.53 270 bottom
R10  28.32,4.45 180 top
R11  19.56,18.67 90 top
R12  53.47,5.46 270 bottom
R13  50.67,5.46 270 bottom
R14  36.07,36.58 180 bottom
R15  38.48,19.3 0 bottom
R16  66.17,18.41 180 bottom
R17  50.55,14.73 180 bottom
R18  37.47,16.26 0 bottom
R19  50.04,32.77 180 bottom
R20  35.94,39.75 0 bottom
R21  29.21,20.32 180 bottom
R22  29.21,22.1 180 bottom
R23  27.69,31.11 180 top
R24  45.85,4.95 0 top
R25  43.81,44.45 90 top
R26  66.04,39.75 270 top
R27  63.12,18.29 90 bottom
R28  62.61,18.29 90 bottom
R29  62.1,18.29 90 bottom
R30  61.59,18.29 90 bottom
R31  61.09,18.29 90 bottom
R32  60.58,18.29 90 bottom
R33  66.04,39.75 270 bottom
R34  15.49,45.97 180 top
R36  23.48,13.08 0 top
R37  23.48,11.81 0 top
R38  30.23,13.97 180 top
R39  16.13,13.34 90 top
R40  17.91,13.34 90 top
R41  29.21,23.88 180 bottom
REFSEL  51.44,8.64 0 top
RESET  23.5,18.29 270 top
STAT  10.29,46.23 0 top
U1  43.81,48.01 0 top
U2  48.39,4.32 180 top
U3  29.21,20.45 90 top
U4  29.21,21.97 90 top
U5  29.21,23.5 90 top

### Tracks (layer width: path | path; a pad name or v marks a point on that pad's centre or on a via)
+3V3  (via drill 0.5, 0.6)
  Top 0.152: 29.21,1.27 29.21,3.3 | 29.21,3.3 29.72,3.81 34.29,3.81 POWER_.4 | 29.21,3.3 29.21,4.41 R10.1 | 34.16,8.51 34.16,8.89 Q4.1 32.98,7.88 Q3.1 | 34.16,9.26 34.16,10.6 Q4.4 | 23.62,16.15 23.62,1.83 24.38,1.07 24.84,1.07 24.89,1.02
  Top 0.203: 19.51,32.56 19.51,32.3 | IC2.142 38.69,16.08 | IC2.154 43.49,16.33 43.31,16.51 | IC2.160 45.89,15.92 | IC2.167 48.69,15.92 48.77,16 | IC2.171 50.29,15.75 | 12.26,29.41 12.26,29.72 IC3.36 12.56,34.29 13.84,34.29 14.35,34.8 v14.35,38.35 | IC3.9 21.61,38.59 | R11.1 22.06,17.72 23.62,16.15 | 24.89,1.02 28.96,1.02 29.21,1.27 | IC3.1 29.38,34.59 v29.65,34.86 29.59,34.92 29.59,41.15 28.57,42.16 25.4,42.16 24,40.77 R4.2
  Top 0.254: IC3.48 19.51,32.56 20.95,31.24 C3.1 | IC2.59 46.69,35.1 v46.35,34.8 | IC2.67 43.49,34.73 v43.43,34.8 | IC2.80 38.29,34.86 v38.1,34.8 | IC2.171 50.29,9.78 REFSEL.1 | 21.61,38.59 22.52,38.59 R4.2 | IC1.8 46.35,10.54 | 50.29,15.75 | R33.1 65.08,40.7 62.99,38.61 57.4,38.61 55.88,37.08 55.88,35.18 55.37,34.67 54.1,34.67 52.32,32.89 49.22,32.89 R19.1 48.64,32.77 48.51,32.51 | IC3.24 13.94,41.76 13.3,41.76 v13.26,41.81
  Top 0.406: 48.07,17.59 v48.01,17.65 47.24,16.89 46.48,16.89 45.85,16.26 | REFSEL.1 54.61,5.46 54.61,1.78 53.98,1.14 36.07,1.14 35.56,1.65 POWER_.4 35.63,2.61 C19.2 35.63,7.05 34.16,8.51 | v66.8,42.04 66.8,41.46 R33.1 | 46.35,10.54 45.97,10.54 44.96,9.53 v44.96,9.3 | 34.28,10.41 33.9,10.41 | 33.9,10.41 Q3.4 | 33.9,10.41 33.9,10.63 Q4.4 34.28,10.47 | 34.16,9.26 34.16,9.19 Q4.1
  Top 0.61: v40.77,19.3 46.61,19.3 46.99,19.68 v47.88,19.68 48.01,19.81 | 38.69,16.08 39.37,16.76 | 39.37,16.76 39.37,17.14 v38.86,17.65 | 39.37,16.76 43.05,16.76 43.31,16.51 43.56,16.26 45.85,16.26 45.89,16.21 45.89,15.92
  Top 0.813: C3.1 21.91,29.66 21.21,29.08 12.9,29.08 12.26,29.72 11.5,30.48 6.99,30.48 5.91,29.4 C2.1 5.84,28.89 5.84,28.32 4.29,26.77 IC4.2 | 21.84,31.56 C3.1 | v46.48,32.51 48.51,32.51 49.02,32.51 49.91,31.62 49.91,20.32 49.4,19.81 48.01,19.81 | 48.07,17.59 48.07,16.7 48.77,16 49.02,15.75 50.29,15.75 | C3.1 21.91,32.07 22.35,32.51 27.94,32.51 v28.07,32.38 28.57,31.88 28.57,31.31 R23.1
  Bottom 0.152: R33.1 65.72,40.7 65.53,40.51
  Bottom 0.203: v29.65,34.86 30.16,34.86 29.21,34.8
  Bottom 0.254: 48.07,17.59 v48.01,17.65 | v46.35,34.8 46.23,34.67 46.1,34.8 | v38.1,34.8 37.02,35.75 R14.2 36.89,36.7 R20.1 | R15.1 v40.77,19.3 | R19.1 46.61,32.77 v46.48,32.51 | v14.35,38.35 14.35,40.72 v13.26,41.81
  Bottom 0.406: C31.2 39.5,36.07 v38.1,34.8 | C32.2 46.48,34.8 | R13.1 50.67,8.13 REFSEL.1 50.77,9.3 v44.96,9.3 C18.2 | 49.6,14.67 R17.1 48.07,16.26 48.07,17.59 | R33.1 66.04,41.27 v66.8,42.04 | R18.1 38.41,16.82 38.86,17.27 v38.86,17.65 39.12,17.4 C11.2
  Bottom 0.813: 46.1,34.8 v43.43,34.8 v38.1,34.8 29.21,34.8 28.7,34.8 28.07,34.16 v28.07,32.38 | v46.35,34.8 46.48,34.8 v46.48,32.51 | v47.88,19.68 47.88,17.78 v48.01,17.65
  Bottom 1.016: v25.53,32.38 v28.07,32.38
+5V  (via drill 0.6)
  Top 0.406: J1.VBUS 5.62,37.37 6.35,38.1 6.35,39.62 | C1.1 0.64,28.96 | IC8.3 12.83,12.36 12.83,13.34 11.81,14.35 IC8.5 11.81,16.57 C28.2 11.74,16.96 | 6.99,20.83 7.24,21.08 | J7.VBUS 5.75,11.21 6.1,11.56 6.1,16.51 7.11,17.53 7.11,20.7 6.73,21.08
  Top 0.61: 10.41,21.08 10.41,20.32 10.79,19.94 10.79,17.91 11.43,17.27 11.43,16.95 C28.2
  Top 0.813: IC4.3 2.06,26.39 0.64,27.69 | 0.64,27.69 0.64,28.96 0.64,41.27 1.27,41.91 5.84,41.91 6.35,41.4 6.35,39.62 6.35,39.12 | 0.64,21.46 1.02,21.08 6.73,21.08 7.24,21.08 10.41,21.08 10.9,21.57 IC5.3 10.9,27.27 C7.1 | 0.64,21.46 0.64,27.69 | 0.64,21.46 0.64,4.45 1.78,3.3 6.99,3.3 7.62,3.94 7.62,4.89 C37.1 v9.53,4.95
  Bottom 1.016: 30.48,1.27 30.99,0.76 37.59,0.76 38.1,1.27 POWER_.5 | POWER_.2 30.48,1.27 | 30.48,1.27 29.97,0.76 17.02,0.76 16.51,1.27 16.51,3.43 14.99,4.95 v9.53,4.95
AS_CLK
  Top 0.254: IC2.168 49.09,8.19 48.77,7.87 47.22,7.87 IC1.6
AS_CS
  Top 0.152: IC2.140 37.89,13 37.52,12.62 36.75,12.62 35.43,11.3 35.43,9.91 35.56,9.78 37.08,9.78 37.85,10.54 IC1.1
  Top 0.254: 40.41,10.41 IC1.1
AS_HOLD
  Top 0.152: IC2.163 47.09,11.91 46.48,11.3 45.47,11.3 43.94,9.78 39.24,9.78 39.12,9.65 39.12,8.61 39.22,8.51 45.24,8.51 46.02,9.3 46.82,9.3 IC1.7 46.72,9.14 46.74,9.14
AS_MISO
  Top 0.152: IC2.165 47.89,11.31 47.62,11.05 45.72,11.05 43.94,9.27 40.54,9.27 IC1.2
AS_MOSI
  Top 0.152: IC2.166 48.29,8.79 48.01,8.51 45.72,8.51 45.47,8.26 45.47,6.86 45.59,6.73 IC1.5
AS_WP
  Top 0.152: IC2.162 46.69,12.14 46.23,11.68 45.34,11.68 43.69,10.03 38.99,10.03 38.86,9.91 38.73,9.78 38.73,8.26 38.99,8 IC1.3
GND  (via drill 0.5, 0.6, 3.2)
  Top 0.127: BANK2.15 BANK2.16
  Top 0.203: IC3.23 14.51,43.14 v14.35,43.05 | J1.ID J1.GND | IC3.47 19.01,31.53 v19.05,31.5 | J7.ID J7.GND | BANK1.15 64.34,19.76 v64.39,19.94 64.07,20.26 BANK1.16 | IC3.35 11.09,35.09 11.05,35.05 11.05,33.4 11.18,33.27 | R34.2 14.52,46.82 v14.48,46.99
  Top 0.254: IC2.33 53.48,29.6 v53.09,29.21 | IC2.38 53.62,31.6 v53.09,31.24 | IC2.21 53.5,24.8 v52.96,25.4 | IC2.13 53.35,21.6 v52.83,22.23 | IC2.9 52.9,20 v52.83,20.07 | IC2.116 34.12,23.2 v34.42,23.24 | C16.1 53.4,37.78 v53.21,37.72 | U2.C v48.39,1.91 | 19.94,37.34 19.94,36.7 | U1.C 43.81,50.67 v43.69,50.8 | IC3.8 19.93,38.09 v19.68,37.85
  Top 0.305: J7.GND 3.46,8.61 J7.SHIELD3 | J7.ID 2.68,9.26 2.03,9.91
  Top 0.406: IC8.1 10.82,12.29 10.79,12.32 10.54,12.32 v9.78,13.08 | 37.68,8.98 v37.72,9.02
  Top 0.813: C7.2 12.76,27.62 v11.18,29.21
  Bottom 0.254: v53.09,31.24 52.58,31.24 | v53.09,29.21 52.83,29.21 | v52.83,22.23 52.83,21.59 52.7,21.72 | v52.83,20.07 52.45,20.07 52.2,20.32 | v34.42,23.24 34.16,23.75 | v53.21,37.72 53.21,37.59 | v48.39,1.91 48.13,2.03 47.88,1.78 | v43.69,50.8 43.69,51.44 | v19.68,37.85 19.56,37.85 19.43,37.72
  Bottom 0.813: v11.18,29.21 10.79,29.21
  other vias: 43.69,25.4 4.95,31.75 4.95,30.61 3.56,30.61 2.29,30.73 6.1,31.75 2.03,43.43 3.56,43.43 5.08,43.43 6.6,43.43 2.03,22.61 3.56,22.61 5.08,22.61 6.6,22.61 8.38,27.05 9.4,29.21 11.18,31.88 8.26,43.43 20.32,30.48 17.78,27.43 17.78,25.53 15.49,23.37 19.3,27.43 25.15,31.24 59.44,33.53 61.21,33.53 61.21,32.26 59.44,32.26 13.46,17.02 14.99,17.02 8.26,18.03 8.26,16.76 25.27,25.65 27.05,17.27 53.21,36.45 42.42,6.35 25.15,29.84 43.18,7.37 26.54,25.65 4.32,4.7 8.38,25.27 6.6,27.05 23.5,21.97 59.44,30.86 61.21,30.86 59.44,29.46 61.21,29.46 8.38,22.61 66.93,24.38 64.64,24.38 67.06,32.51 60.07,22.61 65.41,30.35 61.47,8.89 59.05,12.83 57.78,13.97 57.78,12.83 56.39,13.84 3.56,15.88 2.29,15.88 67.06,19.81 67.31,13.08 22.73,2.54 22.73,4.19 22.48,14.99 22.48,9.4 17.4,7.11 18.67,7.11 16.13,6.6 14.86,6.6 11.43,6.6 21.34,7.37 22.48,8.13 4.32,6.1 5.84,6.6 3.17,4.7 30.86,10.16 27.43,10.03 27.05,18.67 30.86,8.64 30.86,6.73 38.86,6.35 13.21,6.6 62.53,8.89 28.32,18.67 25.27,24.26 19.68,36.45 18.03,36.45 18.03,37.85 40.51,5.84
  pour Bottom (isolate 0.28, rank 2): 0.64,53.98 67.69,53.98 67.94,53.72 67.94,0.64 0.89,0.64 0.64,0.89 0.64,30.1 0.76,30.1 0.76,46.35 0.64,46.35
  pour Top (isolate 0.406, rank 2): 0.64,53.98 67.94,53.98 67.94,0.64 0.64,0.64 0.51,29.34 0.64,30.35
JTAG_CS
  Top 0.2: IC3.14 19.01,40.73 18.37,40.09 IC3.25
JTAG_TCK  (via drill 0.5, 0.6)
  Top 0.2: IC3.26 19.14,39.59 19.51,39.96 IC3.13
  Top 0.203: 16.13,44.83 16.51,44.83 17.14,44.83 18.51,43.46 18.51,42.42 | v15.62,44.83 13.84,44.83 13.21,45.47 13.21,48.01 | 13.21,48.01 13.21,52.32 13.97,53.09 65.28,53.09 65.79,52.58 65.79,42.93 62.36,39.5 52.45,39.5 51.49,38.53 IC2.47 | v13.97,48.01 13.21,48.01 | 18.51,42.42 IC3.15 | IC3.13 19.51,42.46 19.3,42.67 18.77,42.67 18.51,42.42
  Top 0.254: IC3.20 16.01,42.66 v15.62,43.05 | v15.62,44.83 16.13,44.83 | R34.1 16.51,45.85 16.51,44.83
  Bottom 0.2: 10.67,48.01 8,48.01 JTAG.1
  Bottom 0.203: 10.67,48.01 v13.97,48.01
  Bottom 0.254: v15.62,43.05 v15.62,44.83
JTAG_TDI  (via drill 0.5, 0.6)
  Top 0.2: v20.32,40.64 20.71,40.64 IC3.12
  Top 0.203: 12.7,51.82 12.7,44.96 13.72,43.94 v16.5,43.94 16.51,43.96 IC3.19 16.51,41.28 15.75,40.51 10.79,40.51 10.29,40.01 10.29,39.5 11.2,38.59 IC3.28 | 12.7,51.82 12.7,52.58 13.72,53.59 65.53,53.59 66.29,52.83 66.29,42.67 62.74,39.12 52.83,39.12 51.89,38.17 IC2.46 | v12.19,51.82 12.7,51.82
  Bottom 0.2: 18.29,40.64 v20.32,40.64
  Bottom 0.203: v12.19,51.82 11.3,52.7 4.32,52.7 3.3,51.69 3.3,51.18 JTAG.6 | 18.29,40.64 16.51,42.42 16.51,43.96 v16.5,43.94
JTAG_TDO  (via drill 0.5)
  Top 0.203: 67.44,53.34 66.67,54.1 13.21,54.1 11.18,52.07 11.18,49.78 | JTAG.3 9.91,48.51 11.18,49.78 | 11.18,49.78 12.06,48.9 12.06,42.29 v11.56,41.78 | v11.18,39.75 11.84,39.09 IC3.27 IC3.10
  Top 0.254: IC2.43 56.08,33.6 56.77,34.29 56.77,35.69 57.91,36.83 62.36,36.83 65.28,39.75 67.18,39.75 67.69,40.26 67.69,53.09 67.44,53.34
  Bottom 0.203: v11.56,41.78 11.18,41.4 v11.18,39.75
JTAG_TMS  (via drill 0.5, 0.6)
  Top 0.2: IC3.18 17.01,41.15 17.14,41.02 17.4,41.02 17.53,41.15 | 17.53,41.15 17.51,41.16 IC3.17 | 17.53,41.15 17.65,41.02 17.91,41.02 18.01,41.13 IC3.16 | v17.53,45.47 22.1,40.89 22.1,39.75 21.93,39.59 IC3.11 21.12,39.59
  Top 0.203: 17.27,48.01 17.27,51.56 18.29,52.58 65.02,52.58 65.28,52.32 65.28,43.18 62.48,40.39 v62.1,40.39 | v15.24,48.01 17.27,48.01 | IC3.17 17.51,43.17 v17.53,43.18 | 17.27,48.01 17.27,45.72
  Top 0.254: v61.98,37.72 61.72,37.47 57.78,37.47 56.26,35.94 56.26,34.67 55.59,34 IC2.44 | 17.27,45.72 v17.53,45.47
  Bottom 0.203: 13.72,49.53 v15.24,48.01 | v17.53,43.18 v17.53,45.47
  Bottom 0.254: 13.72,49.53 7.49,49.53 JTAG.5 | v62.1,40.39 62.1,37.85 v61.98,37.72
N$1
  Top 0.203: IC2.176 53.74,14.2 54.1,13.84 54.1,11.3 54.36,11.05 57.78,11.05 61.34,7.49 61.34,3.94 62.87,2.54 ADC.6
  Top 0.254: 63.37,2.54 ADC.6 63.37,2.67
N$2
  Top 0.254: IC2.174 51.49,13.03 53.98,10.54 57.66,10.54 60.83,7.37 60.83,2.67 ADC.5
N$3
  Top 0.254: IC2.173 51.09,12.67 53.72,10.03 57.53,10.03 58.29,9.27 58.29,2.67 ADC.4
N$4
  Top 0.254: 56.39,3.05 ADC.3
  Top 0.406: 56.39,3.05 56.39,8.51 REFSEL.3
N$5
  Top 0.254: IC2.170 49.89,5.99 ADC.2
  Bottom 0.813: R12.2 53.47,2.67 ADC.2
N$6
  Top 0.254: IC2.169 49.49,3.85 ADC.1
  Bottom 0.813: R13.2 50.67,2.67 ADC.1
N$7
  Top 0.254: IC2.69 42.69,47.39 42.93,47.62 42.93,48.9 41.66,50.16 IO1.10
N$8
  Top 0.254: IC2.70 42.29,47.63 IO3.10
N$9
  Top 0.254: IC2.71 41.89,44.98 40.39,46.48 40.39,49.53 IO1.9
N$10
  Top 0.254: IC2.72 41.49,44.62 39.12,46.99 IO3.9
N$11
  Top 0.254: IC2.73 41.09,44 37.85,47.24 37.85,49.53 IO1.8
N$12
  Top 0.254: IC2.74 40.69,43.39 36.58,47.5 IO3.8
N$13
  Top 0.254: IC2.75 40.29,42.01 35.31,46.99 35.31,49.53 IO1.7
N$14
  Top 0.254: IC2.76 39.89,41.65 34.04,47.5 IO3.7
N$15
  Top 0.254: IC2.77 39.49,40.9 32.77,47.5 32.77,49.53 IO1.6
N$16
  Top 0.254: IC2.78 39.09,40.29 31.75,47.5 31.75,48.01 IO3.6
N$17
  Top 0.254: IC2.79 38.69,39.8 32,46.48 30.99,46.48 30.23,47.24 30.23,49.53 IO1.5
N$18
  Top 0.254: IC2.83 37.09,39.11 31.5,44.7 26.16,44.7 23.88,46.99 IO3.3
N$19
  Top 0.254: IC2.81 37.89,39.84 32,45.72 30.99,45.72 29.21,47.5 29.21,48.01 IO3.5
N$20
  Top 0.254: IC2.82 37.49,39.47 31.75,45.21 26.92,45.21 25.15,46.99 25.15,49.53 IO1.3
N$21
  Top 0.254: IC2.84 36.69,38.75 31.5,43.94 25.91,43.94 22.61,47.24 22.61,49.53 IO1.2
N$22
  Top 0.254: IC2.86 35.89,38.79 31.24,43.43 25.65,43.43 21.34,47.75 IO3.2
N$23
  Top 0.203: IC2.89 31.79,34 31.5,34.29
  Top 0.254: IO1.1 20.07,49.53 20.07,46.61 23.75,43.05 29.46,43.05 31.5,41.02 31.5,34.29
N$24
  Top 0.203: IC2.90 31.3,33.6 31.11,33.78
  Top 0.254: 31.11,33.78 31.11,40.77 29.34,42.55 22.48,42.55 18.8,46.23 IO3.1
N$25
  Top 0.254: J1.D+ 7.18,36.07 R2.1
N$26
  Top 0.254: J1.D- 6.81,36.72 R1.1
N$27
  Top 0.254: IC3.32 10.59,36.59 R1.2
N$28
  Top 0.254: R3.2 R2.2 10.11,36.09 IC3.33
N$29
  Top 0.203: R3.1 7.69,33.34 8.64,34.29 8.64,38.48 8.89,38.73 10.41,38.73 11.06,38.09 IC3.29
N$30  (via drill 0.5)
  Top 0.203: IC3.31 12.7,37.09 v13.59,36.2
  Bottom 0.203: J2.1 15.24,34.67 v13.59,36.2
N$31  (via drill 0.5)
  Top 0.203: IC3.30 13.33,37.59 v13.59,37.34
  Bottom 0.203: J4.1 14.22,36.7 v13.59,37.34
N$32
  Top 0.203: IC3.7 23.43,37.59 R4.1
N$33
  Top 0.203: IC3.22 15.01,41.18 14.86,41.02 10.86,41.02 R5.1
N$34
  Top 0.203: STAT.A 10.29,43.65 R5.2
N$35
  Top 0.203: IC3.5 27.29,36.59 Q1.2
  Bottom 0.203: C4.1 27.24,36.39 Q1.2
N$36
  Top 0.203: IC3.6 25.28,37.09 27.56,39.37 Q1.1
  Bottom 0.203: C5.1 Q1.1
N$37
  Top 0.203: IC3.44 17.51,32.25 16.51,31.24 R6.1
N$38
  Top 0.203: IC2.49 50.69,38.5 52.07,39.88 56.01,39.88 63.12,46.99 64.14,46.99 64.9,47.75 64.9,49.4 IO2.8
N$40
  Top 0.203: IC2.51 49.89,38.71 52.07,40.89 55.5,40.89 62.23,47.62 62.23,49.53 IO2.7
N$42
  Top 0.203: IC2.53 49.09,38.93 52.07,41.91 53.98,41.91 59.69,47.62 59.69,49.53 IO2.6
N$43
  Top 0.203: IC2.54 48.69,39.04 52.07,42.42 52.58,42.42 IO4.6
N$44
  Top 0.203: IC2.55 48.29,39.27 56.01,46.99 56.39,46.99 57.15,47.75 57.15,49.66 IO2.5
N$45
  Top 0.203: IC2.56 47.89,39.51 56.01,47.62 56.01,48.13 IO4.5
N$46
  Top 0.203: IC2.57 47.49,39.61 54.61,46.74 54.61,49.53 IO2.4
N$47
  Top 0.203: IC2.58 47.09,39.72 53.34,45.97 IO4.4
N$48
  Top 0.203: IC2.60 46.29,39.68 52.07,45.47 52.07,49.53 IO2.3
N$49
  Top 0.203: IC2.61 45.89,40.05 51.05,45.21 51.05,48.01 IO4.3
N$50
  Top 0.203: IC2.62 45.49,40.41 49.53,44.45 49.53,49.53 IO2.2
N$51
  Top 0.203: IC2.63 45.09,41.02 48.26,44.2 IO4.2
N$52
  Top 0.203: IC2.64 44.69,41.64 46.99,43.94 46.99,49.53 IO2.1
N$53
  Top 0.254: IC2.66 43.89,41.73 45.85,43.69 45.85,48.13 IO4.1
N$54
  Top 0.152: IC2.161 46.29,12.25 45.97,11.94 45.21,11.94 44.44,11.17 38.24,11.17 Q3.3 36.73,10.68 Q4.3
N$55
  Top 0.254: IC2.172 50.69,11.92 REFSEL.2
  Bottom 0.254: 56.01,6.86 C10.2 53.98,8.57 REFSEL.2
N$56
  Top 0.203: IC2.119 31.27,22 31.11,21.84 31.11,21.18 U3.A
N$57
  Top 0.203: IC2.118 30.82,22.4 U4.A
N$58
  Top 0.406: L2.2 11.84,10.79 | 11.84,10.79 11.84,12.26 IC8.2 | C29.2 9.27,11.56 10.03,10.79 11.84,10.79
N$59
  Top 0.406: IC8.6 10.83,14.86 9.78,14.86 9.46,14.54 C29.1
N$60
  Top 0.406: R7.1 13.75,14.89 IC8.4
N$61
  Top 0.254: R7.2 R39.1 16.13,12.51 R40.2
N$62  (via drill 0.6)
  Top 0.254: IC2.5 52.97,18.4 v52.83,18.29
  Bottom 0.254: 52.77,18.54 v52.83,18.29 52.64,18.48 R9.1
  Bottom 0.305: R8.2 50.42,17.59 R9.1
N$63
  Top 0.254: IC2.2 56.59,17.2 61.03,12.76 BANK1.1
N$64
  Top 0.254: BANK1.2 61.29,13.26 56.95,17.6 IC2.3
N$65
  Top 0.254: IC2.4 57.18,18 61.42,13.76 BANK1.3
N$66
  Top 0.254: IC2.6 56.89,18.8 61.43,14.26 BANK1.4
N$67
  Top 0.254: IC2.8 56.6,19.6 61.47,14.73 62.38,14.73 BANK1.5
N$68  (via drill 0.5)
  Top 0.203: IC3.34 13.05,35.59 v13.59,35.05
  Bottom 0.203: J5.1 11.94,36.7 v13.59,35.05
N$69
  Top 0.254: IC2.11 56.42,20.8 61.47,15.75 62.4,15.75 BANK1.7
N$70
  Top 0.254: BANK1.8 61.59,16.26 55.85,22 IC2.14
N$71
  Top 0.254: IC2.15 55.96,22.4 61.59,16.76 BANK1.9
N$72
  Top 0.254: IC2.16 56.07,22.8 61.59,17.27 62.4,17.27 BANK1.10
N$73
  Top 0.254: IC2.17 56.17,23.2 61.59,17.78 62.39,17.78 BANK1.11
N$74
  Top 0.254: IC2.19 55.88,24 61.59,18.29 62.38,18.29 BANK1.12
N$75
  Top 0.203: 61.72,18.8 61.59,18.8 56.26,24.13 56.26,24.89 55.95,25.2 IC2.22
  Top 0.254: 61.72,18.8 62.37,18.8 BANK1.13
N$76
  Top 0.203: 61.72,19.3 61.59,19.3 56.64,24.26 56.64,25.02 56.06,25.6 IC2.23
  Top 0.254: 61.72,19.3 62.37,19.3 BANK1.14
N$77
  Top 0.127: IC2.25 56.28,26.4 56.52,26.16 57.65,26.16 BANK2.1
N$78
  Top 0.127: IC2.26 56.51,26.8 56.64,26.67 57.66,26.67 BANK2.2
N$79
  Top 0.127: IC2.27 57.69,27.2 BANK2.3
N$80
  Top 0.127: IC2.28 56.43,27.6 56.52,27.69 57.67,27.69 BANK2.4
N$81
  Top 0.127: IC2.29 56.45,28 56.64,28.19 57.68,28.19 BANK2.5
N$82
  Top 0.127: IC2.30 56.34,28.4 56.64,28.7 57.69,28.7 BANK2.6
N$83
  Top 0.127: IC2.31 56.1,28.8 56.52,29.21 57.7,29.21 BANK2.7
N$84
  Top 0.127: IC2.32 56,29.2 56.52,29.72 BANK2.8
N$85
  Top 0.127: IC2.35 56.59,30.4 56.77,30.23 BANK2.9
N$86
  Top 0.127: IC2.36 57.63,30.8 BANK2.10
N$87
  Top 0.127: IC2.37 57.69,31.2 BANK2.11
N$88
  Top 0.127: IC2.39 56.27,32 56.52,31.75 57.68,31.75 BANK2.12
N$89
  Top 0.127: IC2.41 56.1,32.8 56.64,32.26 57.67,32.26 BANK2.13
N$90
  Top 0.127: IC2.42 56.21,33.2 56.64,32.77 57.67,32.77 BANK2.14
N$91  (via drill 0.5)
  Top 0.254: IC2.175 51.89,13.14 52.2,12.83 52.58,12.83 v53.21,13.46
  Bottom 0.254: C20.2 R17.2 | C20.2 52.96,15.05 52.96,15.49 | v53.21,13.46 53.21,14.79 C20.2
N$92
  Top 0.254: IC2.88 33.63,36.6 HSWAPEN.1
  Bottom 0.254: R14.1 33.66,36.58 HSWAPEN.1
N$93  (via drill 0.6)
  Top 0.254: IC2.139 37.49,17.5 v37.59,17.65
  Bottom 0.254: v37.59,17.65 37.59,19.24 R15.2
N$94  (via drill 0.6)
  Top 0.254: IC2.135 35.89,15.8 v35.43,16.26
  Bottom 0.254: 34.23,15.87 C21.2
  Bottom 0.406: R18.2 v35.43,16.26
  Bottom 0.61: C21.2 35.31,16.38 v35.43,16.26
N$95  (via drill 0.6)
  Top 0.254: IC2.45 52.29,34.76 v52.2,34.8
  Bottom 0.254: R19.2 C22.2
  Bottom 0.406: C22.2 51.94,34.54 v52.2,34.8
N$96  (via drill 0.6)
  Top 0.254: IC2.87 35.49,37.79 v34.92,38.35
  Bottom 0.254: v34.92,38.35 34.92,39.69 R20.2 C23.2
N$97
  Top 0.203: IC2.115 30.62,23.6 U5.A
N$98
  Top 0.254: 28.64,29.84 PWR.A 28.32,29.59 26.86,31.05 R23.2
N$99
  Top 0.254: R24.2 48.35,4.95 U2.A
N$100
  Top 0.152: R24.1 44.77,5.08 36.83,5.08 36.58,5.33 36.58,7.11 35.05,8.64 35.05,11.46 36.55,12.95 36.96,12.95 37.09,13.09 IC2.138
  Top 0.254: 44.77,5.21 R24.1
N$101
  Top 0.254: R25.2 U1.A
N$102
  Top 0.254: IC2.68 43.09,42.07 43.81,42.8 R25.1
N$103  (via drill 0.3)
  Top 0.406: R26.2 65.47,38.8 63.88,37.21 63.88,27.05 62.74,25.91 59.94,25.91 v58.93,24.89
  Bottom 0.254: JP1.4 56.13,24.91 | 56.13,24.91 55.67,24.91 C39.2 | 56.26,24.78 56.13,24.91
  Bottom 0.406: v58.93,24.89 57.49,24.89 JP1.4
N$104
  Bottom 0.152: JP1.1 62.63,28.18 63.12,27.69 R27.2
N$105
  Top 0.152: R10.2 27.05,4.45 PROGRAM.2 PROGRAM.1 25.78,10.92 | 28.89,12.76 28.83,12.83
  Top 0.254: IC2.134 35.49,13.14 35.18,12.83 28.83,12.83 28.19,12.83 25.91,10.54 PROGRAM.1
N$106
  Bottom 0.152: JP1.2 58.03,27.06 | 58.03,27.06 58.04,27.05 | 58.03,27.06 62.48,27.06 62.61,26.92 R28.2
N$107
  Bottom 0.152: JP1.3 61.5,26 62.1,25.4 R29.2
N$108
  Bottom 0.152: JP1.8 60.35,20.55 60.58,20.32 R32.2
N$109
  Bottom 0.152: JP1.7 60.67,21.63 61.09,21.21 R31.2
N$110  (via drill 0.5)
  Top 0.203: IC3.37 13.77,32.84 v13.08,33.53
  Bottom 0.203: J6.1 12.57,34.04 v13.08,33.53
N$111
  Bottom 0.152: JP1.5 60.98,23.85 61.59,23.24 R30.2
N$112
  Bottom 0.152: 54.93,19.73 JP1.GND3
  Bottom 0.406: 54.93,19.73 54.93,18.16 C40.1
N$114  (via drill 0.5)
  Top 0.254: IC2.10 56.31,20.4 61.47,15.24 62.39,15.24 BANK1.6 65.81,15.26 v66.93,16.38
  Bottom 0.203: R16.2 67.02,16.89
  Bottom 0.254: 67.02,17.02 67.02,16.89
  Bottom 0.406: v66.93,16.38 66.93,16.8 67.02,16.89
N$116
  Top 0.152: R36.1 22.48,13.08 21.61,12.22 20.47,12.22 19.79,11.53 19.79,6.58 18.54,5.33 10.79,5.33 5.59,10.54 4.9,10.54 J7.D-
N$117
  Top 0.152: R37.1 20.6,11.81 20.19,11.4 20.19,6.45 18.67,4.93 10.82,4.93 5.71,9.91
  Top 0.305: J7.D+ 5.71,9.91
N$118  (via drill 0.5)
  Top 0.203: v27.18,20.45 U3.C
  Bottom 0.203: R21.1 v27.18,20.45
N$119  (via drill 0.5)
  Top 0.203: U4.C 27.56,21.84 v27.18,22.23
  Bottom 0.203: v27.18,22.23 R22.1
N$120  (via drill 0.5)
  Top 0.203: v27.18,23.88 27.52,23.88 U5.C
  Bottom 0.203: R41.1 26.92,24 v27.18,23.88
RESET  (via drill 0.5)
  Top 0.152: 23.32,15.54 23.32,6.68 22.73,6.1
  Top 0.203: POWER_.3 33.02,1.52 32.13,0.64 20.57,0.64 20.19,1.02 20.19,5.59 20.7,6.1 22.73,6.1 | R11.2 18.29,18.35 18.29,17.14 18.8,16.64 22.23,16.64 23.32,15.54 | 23.94,19.62 25.72,19.62 25.78,19.56
  Top 0.254: R11.2 23.94,19.62 | IC2.136 36.29,16.93 35.94,17.27 34.67,17.27 33.15,15.75 26.67,15.75 RESET.2 v25.78,18.67 25.78,19.56 RESET.1
  Bottom 0.203: C15.2 25.59,18.48 v25.78,18.67
SD_CD  (via drill 0.3 pad 0.18)
  Top 0.152: IC2.150 41.89,13.19 41.4,12.7 40.26,12.7 v39.37,11.81
  Bottom 0.152: R33.2 67.75,38.8 68.2,38.35 68.2,27.2 JP1.CD2 63.86,27.05 | 63.86,27.05 63.76,27.05 | v39.37,11.81 41.12,10.06 62.33,10.06 63.55,11.28 63.55,26.75 63.86,27.05
SD_CMD  (via drill 0.3 pad 0.18)
  Top 0.152: IC2.153 43.09,12.48 v42.42,11.81
  Bottom 0.152: 42.42,11.56 v42.42,11.81 43.26,10.97 61.42,10.97 62.1,11.66 R29.1
SD_D0  (via drill 0.3 pad 0.18)
  Top 0.152: IC2.157 44.7,14.18 44.7,13.21 v45.34,12.57
  Bottom 0.152: R32.1 60.58,12.12 60.35,11.89 45.72,11.89 45.34,12.27 v45.34,12.57
SD_D1  (via drill 0.3 pad 0.18)
  Top 0.152: IC2.156 44.29,12.35 v44.32,12.32
  Bottom 0.152: R31.1 61.09,11.84 60.83,11.58 45.11,11.58 44.37,12.32 v44.32,12.32
SD_D2  (via drill 0.3 pad 0.18)
  Top 0.152: IC2.151 42.29,13.21 42.29,13.08 41.66,12.45 41.02,12.45 v40.39,11.81
  Bottom 0.152: R27.1 63.12,11.46 62.03,10.36 41.83,10.36 v40.39,11.81
SD_D3  (via drill 0.3 pad 0.18)
  Top 0.152: IC2.152 42.67,14.18 42.67,13.08 v41.4,11.81
  Bottom 0.152: v41.4,11.81 41.4,11.79 42.52,10.67 61.72,10.67 62.64,11.58 62.64,18.01 R28.1
SD_SCLK  (via drill 0.3 pad 0.18)
  Top 0.152: IC2.155 43.89,12.77 43.43,12.32 v43.43,11.81
  Bottom 0.152: R30.1 61.59,11.58 61.57,11.58 61.27,11.28 43.97,11.28 v43.43,11.81
SPI_CLK
  Top 0.203: IC2.91 30.3,33.2 29.21,34.29 20.45,34.29 20.07,34.67 16,34.67 15.01,33.68 IC3.39
SPI_CS
  Top 0.203: IC3.42 16.51,33.41 16.69,33.58 19.63,33.58 20.07,33.15 28.45,33.15 30,31.6 IC2.95
SPI_MISO
  Top 0.203: IC3.40 15.51,33.42 16.38,34.29 19.94,34.29 20.32,33.91 28.96,33.91 30.48,32.38 32.47,32.38 IC2.93
SPI_MOSI
  Top 0.203: IC3.41 16.01,33.41 16.51,33.91 19.81,33.91 20.19,33.53 28.7,33.53 30.23,32 IC2.94
USBDM  (via drill 0.3)
  Top 0.152: v39.75,15.88 39.5,15.62 IC2.144 | v33.4,14.99 33.27,15.11 28.57,15.11 26.42,12.95 24.51,12.95 R36.2
  Bottom 0.152: v39.75,15.88 38.86,14.99 v33.4,14.99
USBDP  (via drill 0.3)
  Top 0.152: 39.88,14.21 IC2.145 | 29.46,14.73 28.7,14.73 25.78,11.81 R37.2 | 29.46,14.73 32.64,14.73 v33.4,13.97 | R38.2 29.38,14.64 29.46,14.73
  Top 0.203: 39.88,14.21 39.88,15.24 v40.89,15.88
  Bottom 0.152: v33.4,13.97 34.16,14.73 39.75,14.73 v40.89,15.88
USBPULL  (via drill 0.3)
  Top 0.152: v34.42,14.1 33.66,13.34 31.71,13.34 R38.1 | v41.91,15.88 41.09,15.18 IC2.148
  Bottom 0.152: v34.42,14.1 34.8,14.48 40.26,14.48 v41.91,15.88
USER_RX
  Top 0.203: IC2.52 49.49,38.82 52.07,41.4 54.1,41.4 IO4.7
USER_TX
  Top 0.203: IC2.50 50.29,38.6 52.07,40.39 55.63,40.39 IO4.8
VCC/2  (via drill 0.5, 0.6)
  Top 0.203: IC2.96 34.33,31.2 34.54,30.99 | 34.53,21.6 34.54,21.59 | IC2.125 34.5,19.6 34.54,19.56 | IC2.105 34.38,27.6 34.54,27.43 | 34.53,26.4 34.54,26.42 | IC2.24 56.17,26 57.02,25.15 57.02,24.51 60.71,20.83 65.15,20.83 65.79,20.19 v65.79,19.81
  Top 0.254: IC2.40 53.61,32.4 53.59,32.38 52.58,32.38 51.31,31.11 v51.31,30.61 51.56,30.48 | 34.53,26.4 IC2.108 30.65,26.4 30.38,26.13 30.1,25.85 | IC2.120 34.42,21.6 | IC2.117 33.59,22.8 34.16,22.23 34.16,21.85 34.42,21.6 | IC2.34 53.57,30 | IC2.24 53.5,26 51.94,27.56 | IC2.12 52.21,21.2 52.07,21.34 | 52.07,21.34 51.94,21.46 | IC2.18 53.7,23.6 53.21,23.11 52.07,23.11 51.94,23.11 | IC2.7 52.3,19.2 51.94,19.56 v51.94,21.21 52.07,21.34 | 34.42,21.6 34.42,21.59 34.54,21.46 | IC2.125 31.16,19.6 30.48,18.92 30.48,17.46 C25.2
  Top 0.305: 53.57,30 53.31,30 52.96,30.35
  Top 0.406: 34.54,30.99 34.54,27.43 34.54,26.42 35.31,25.65 35.31,21.97 35.05,21.72 34.67,21.72 34.54,21.59 34.54,21.46 34.54,19.56 | 13.46,24.97 13.21,25.22 IC5.2 | 51.94,21.46 51.94,22.99 52.07,23.11 51.94,23.24 51.94,27.56 51.94,30.1 v51.31,30.61 51.56,30.35 52.96,30.35
  Top 0.61: 30.1,25.85 C24.2
  Top 0.813: IC5.2 13.18,25.63 14.22,26.67 14.22,27.37 C6.1 | 13.21,25.22 13.21,23.62 14.61,22.1 16.89,22.1 v21.97,27.18 | 34.54,26.42 34.54,31.24 v34.67,31.37 | v37.21,31.37 47.88,31.37 v48.64,30.61 | v25.27,27.18 29.34,27.18 30.38,26.13
  Bottom 0.203: R16.1 65.22,19.24 v65.79,19.81
  Bottom 0.254: C26.2 51.37,30.55 v51.31,30.61 | v51.94,21.21 C27.2
  Bottom 0.406: R8.1 49.59,19.49 50.55,20.45 50.55,21.15 C27.2
  Bottom 0.813: v21.97,27.18 v25.27,27.18 | v34.67,31.37 v37.21,31.37 | v48.64,30.61 v51.31,30.61
VCCINT  (via drill 0.6)
  Top 0.203: IC2.20 54.86,24.38 | IC2.92 34.07,32.8 | IC2.85 36.29,34.51 | IC2.137 36.69,15.64 | IC2.164 47.49,14.85
  Top 0.254: 51.18,16.8 IC2.1 54.55,16.46 C17.2 | IC2.48 51.09,34.45 50.55,33.91 50.55,33.66 | IC2.65 44.29,33.94 44.58,33.66 | IC2.113 33.92,24.4 v34.42,24.89 | IC2.20 53.23,24.4 v52.96,24.13 | IC2.128 34.69,18.4 v35.05,18.16 | C16.2 54.74,35.56 | IC2.92 34.51,32.8 v34.67,32.77 | 47.49,14.85 47.49,15.5 v46.99,16 | 36.69,15.64 36.69,17.67 36.26,18.1
  Top 0.406: 15.84,9.02 L2.1 | C12.2 R40.1 | 34.07,32.8 34.58,32.8 | 36.83,33.66 36.58,33.66 36.45,33.66 | v38.99,33.53 38.99,33.66 | 54.68,35.88 C16.2 54.55,35.88 52.45,33.78 51.94,33.78 51.82,33.66 | v30.48,30.73 v30.48,29.72
  Top 0.61: v34.67,32.77 35.56,33.66 36.58,33.66 | 36.26,18.1 36.07,18.16 | 36.07,33.15 36.45,33.66 | 36.29,34.51 36.29,34.2 36.83,33.66 38.86,33.66 v38.99,33.53 | v46.48,17.78 46.61,17.78 47.5,18.67 49.44,18.67 | 49.44,18.67 51.18,16.8 | 49.44,18.67 50.29,18.67 50.93,19.3 50.93,21.72 51.18,21.97 51.18,23.37 v51.05,23.5 | 50.55,33.66 51.82,33.66 | v36.7,25.02 36.07,25.02
  Top 0.813: v35.05,18.16 36.07,18.16 36.07,25.02 36.07,33.15 | R40.1 19.12,12.38 19.81,13.08 19.81,14.99 18.92,15.88 17.65,15.88 17.27,16.26 17.27,20.57 23.75,27.05 23.75,27.81 24.26,28.32 29.97,28.32 30.48,28.83 v30.48,29.72 | 38.99,33.66 44.58,33.66 50.55,33.66 | 15.84,9.02 15.84,10.26 16.13,10.54 17.84,10.54 C12.2 | v46.48,17.78 40.51,17.78 39.5,18.8 36.96,18.8 36.26,18.1
  Bottom 0.254: v52.96,24.13 51.82,24.13 v51.05,23.5 | v35.05,18.16 C14.2
  Bottom 0.406: C33.2 34.61,25.09 v34.42,24.89 | 39.18,33.34 v38.99,33.53 | C36.2 51.12,23.56 v51.05,23.5 | 46.99,16.38 v46.99,16 46.99,17.27 v46.48,17.78
  Bottom 0.61: 34.61,25.09 36.64,25.09 v36.7,25.02 | v46.48,17.78 C34.2 | C35.2 39.24,33.27 v38.99,33.53
  Bottom 0.813: v30.48,29.72 30.48,30.99 31.37,31.88 32.32,31.88 C13.2
  Bottom 1.016: v34.67,32.77 33.21,32.77 C13.2

### Text on the board
tPlace: 68 | TDI | TMS | GND | TDO | GND | 49 | TCK | + | 89 / 90 | 84 / 86 | 82 / 83 | 79 / 81 | 77 / 78 | 75 / 76 | 73 / 74 | 71 / 72 | 69 / 70 | 64 / 66 | 62 / 63 | 60 / 61 | 57 / 58 | 55 / 56 | 53 / 54 | 51 / 52 | 50 | Layout by / Zhiyuan Wan | + | + | Design for | RISC-V | 3.3 | 2.5 | 136 | INT3V3 | EXT | 1.2 | 138 | + | + | EG4duino | + | Made in China
bPlace: github.com/AnlogicInfo | Anlogic Technologies / Feb.2017 Rev.4 | www.anlogic.com | +
tNames: GND | DIGITAL | TX | RX | ANALOG IN | VIN | RST | 3V3 | VIN | GND | M0 | M1 | REF | A0 | 174 | A1
ReferenceLC: L | TX | ON | RX | PC1 | PC2
214bmp: D:/SmartProjects/Snc/a4_bn_logo2.bmp